# Altium project Power Circuit.PrjPcb
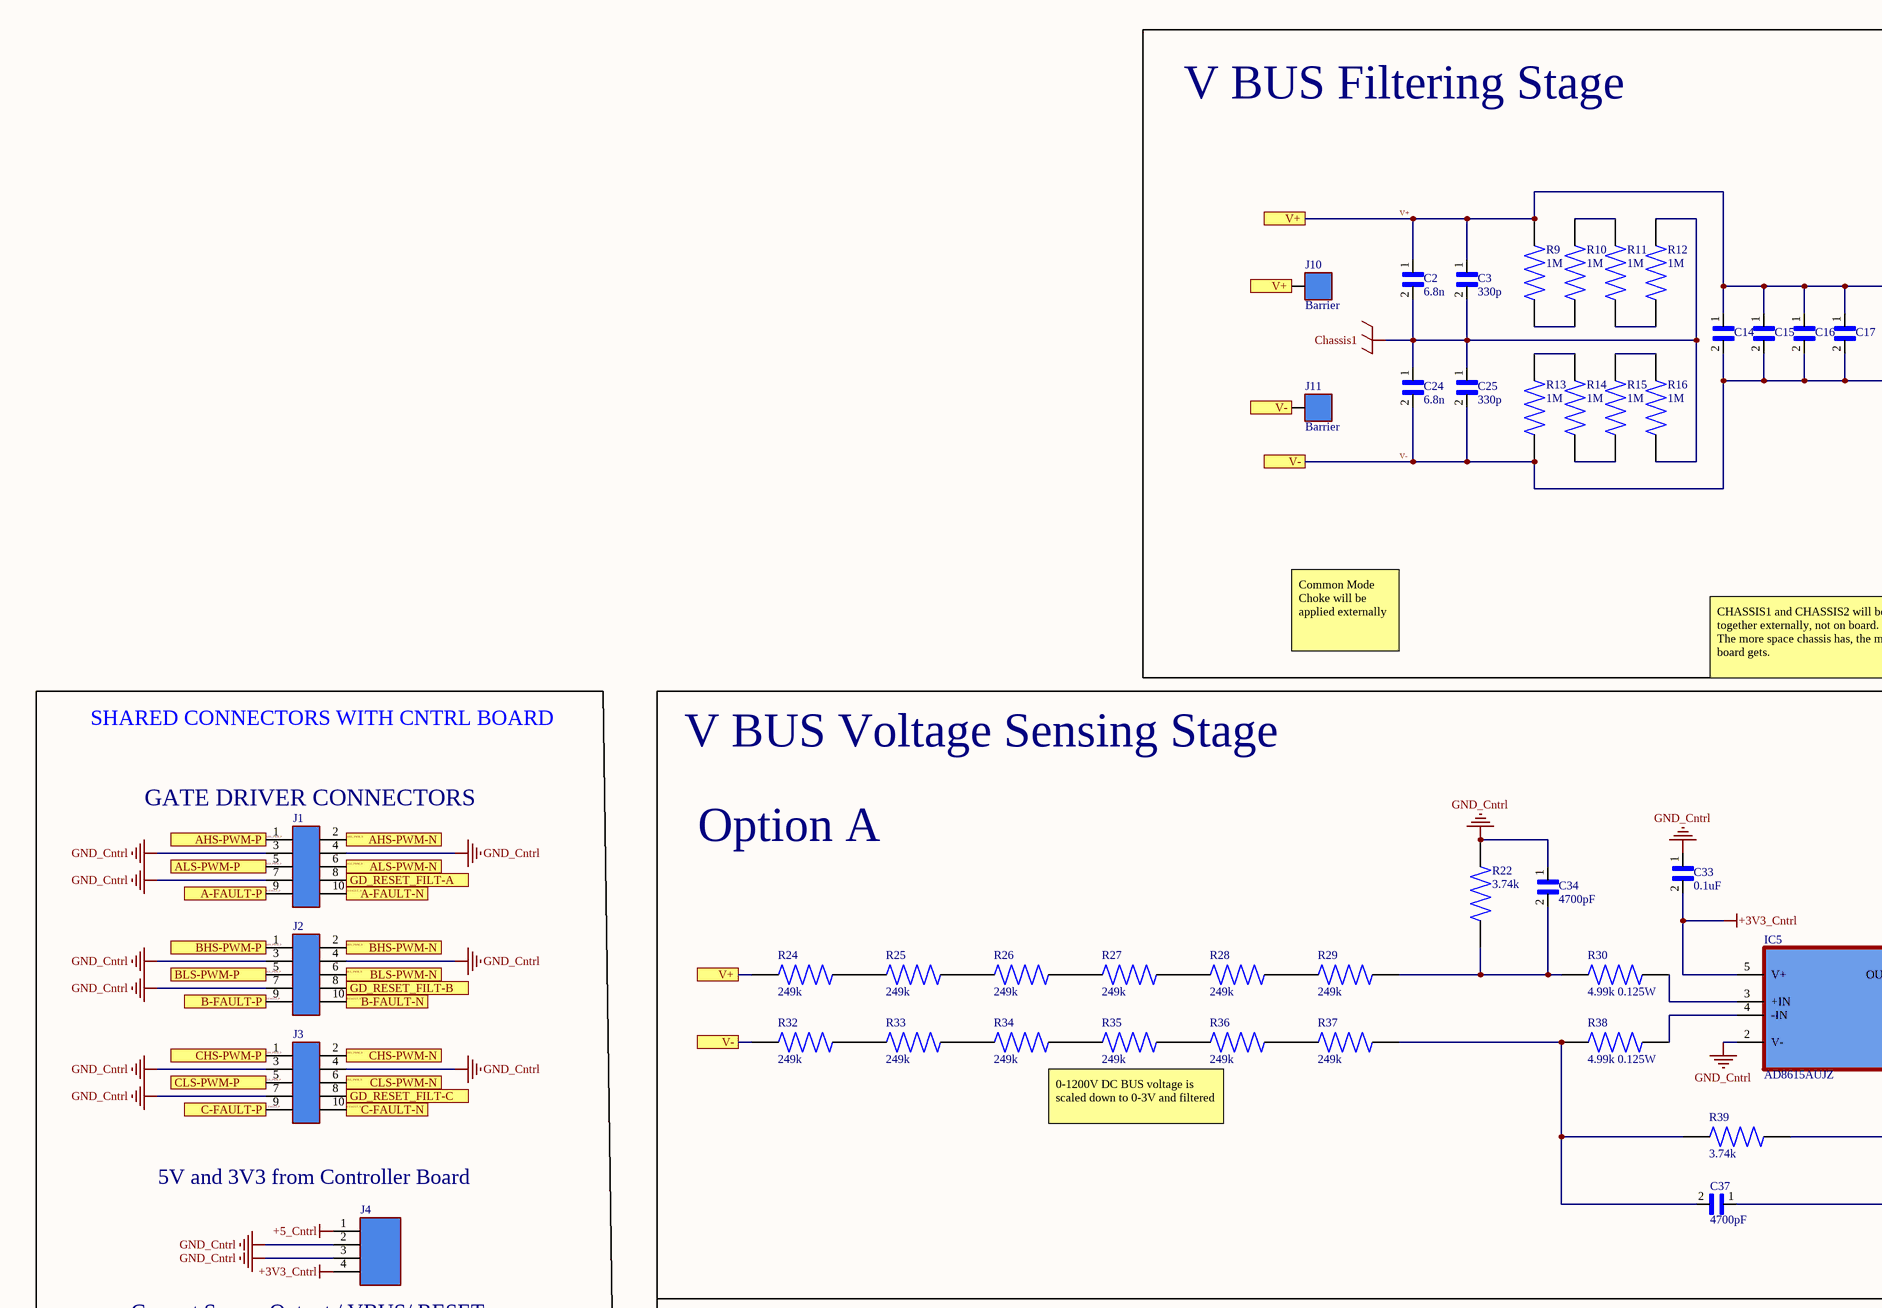
[diagram p0: Circuit.SchDoc, top left]
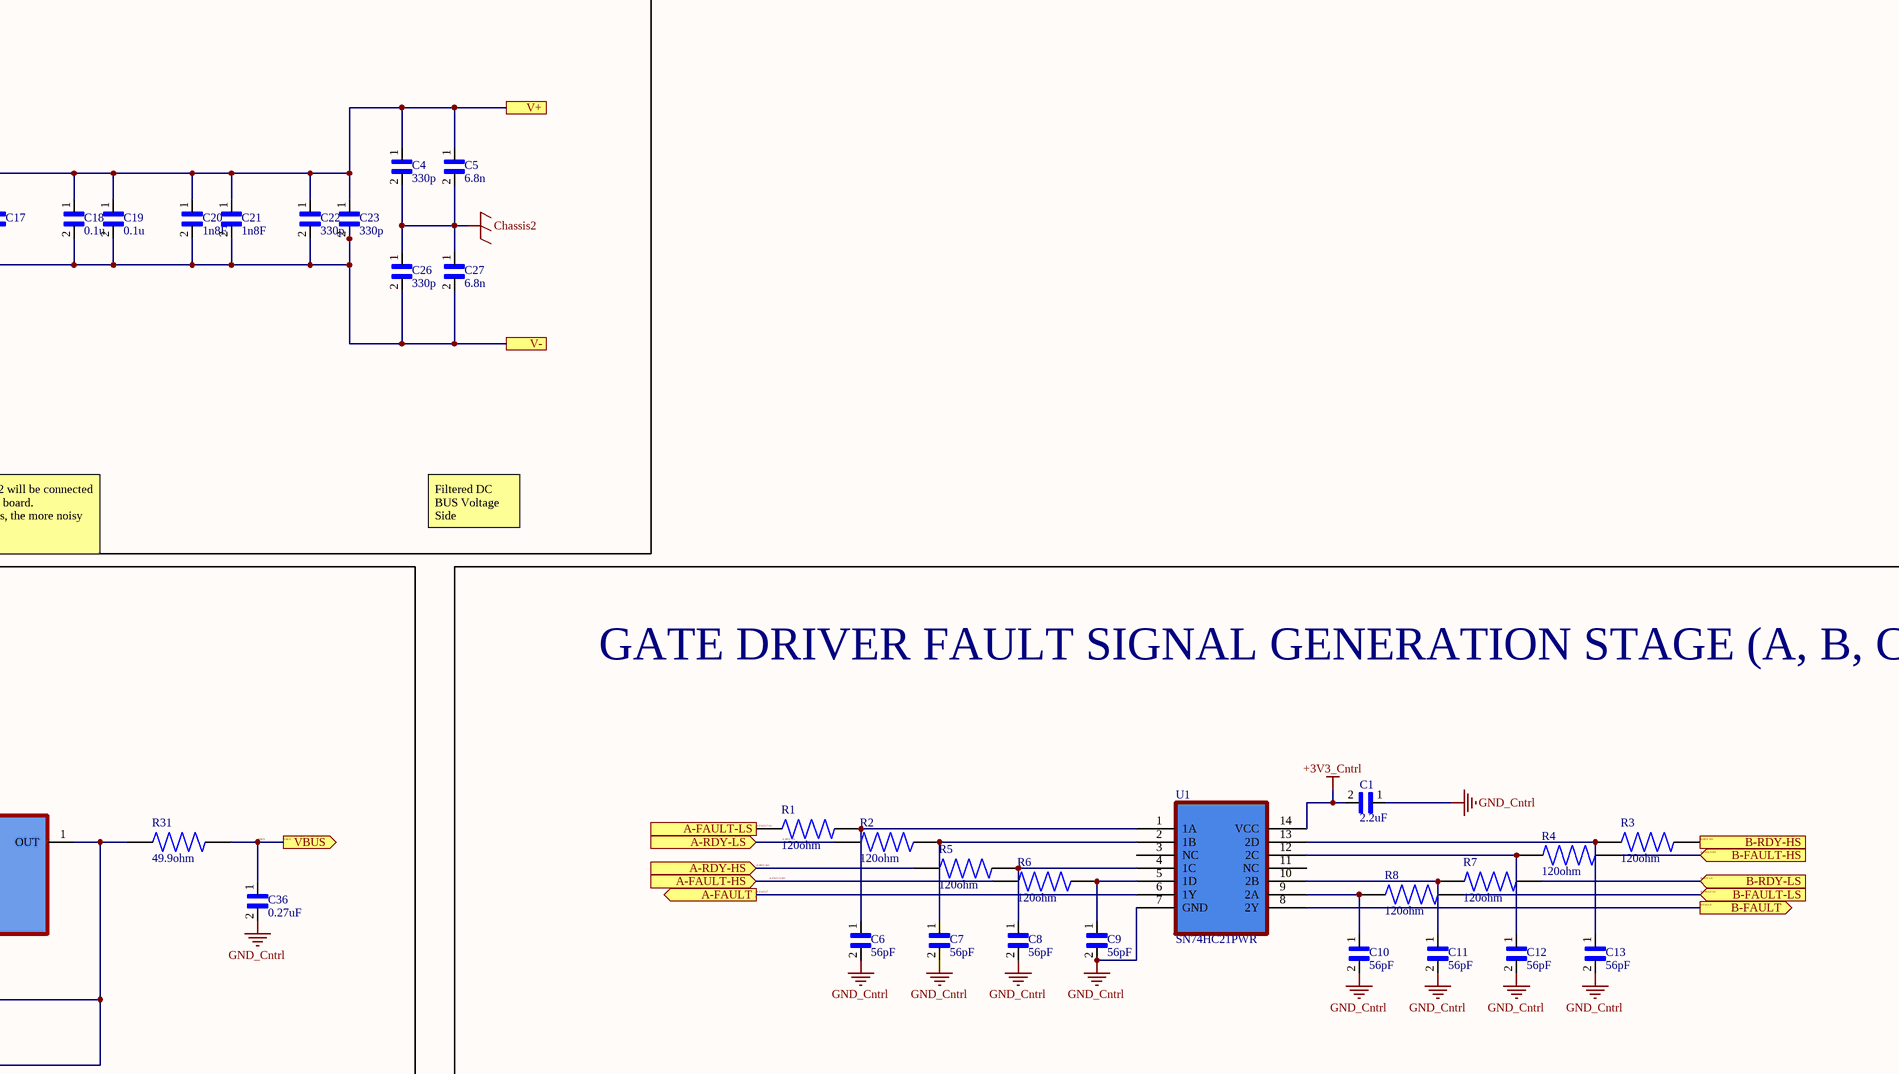
[diagram p1: Circuit.SchDoc, top right]
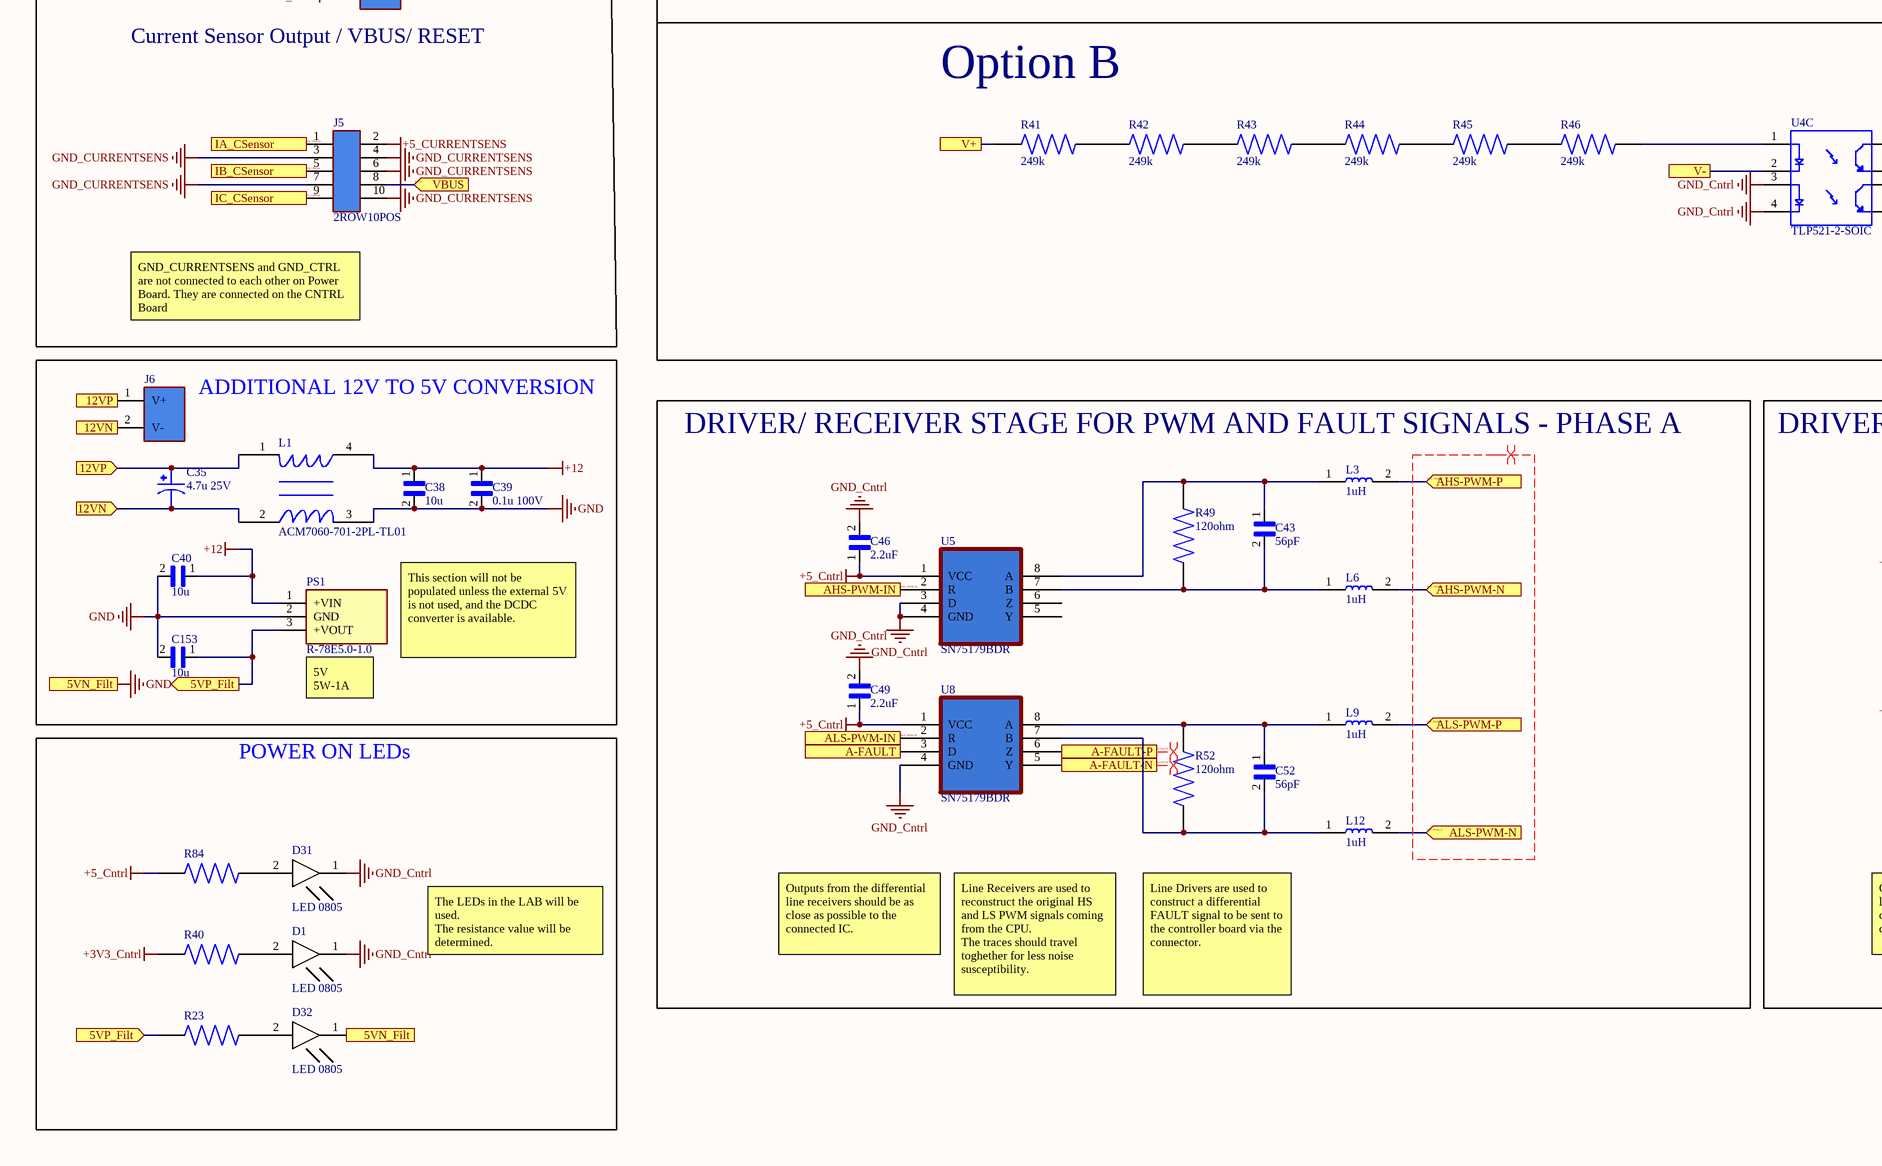
[diagram p2: Circuit.SchDoc, bottom left]
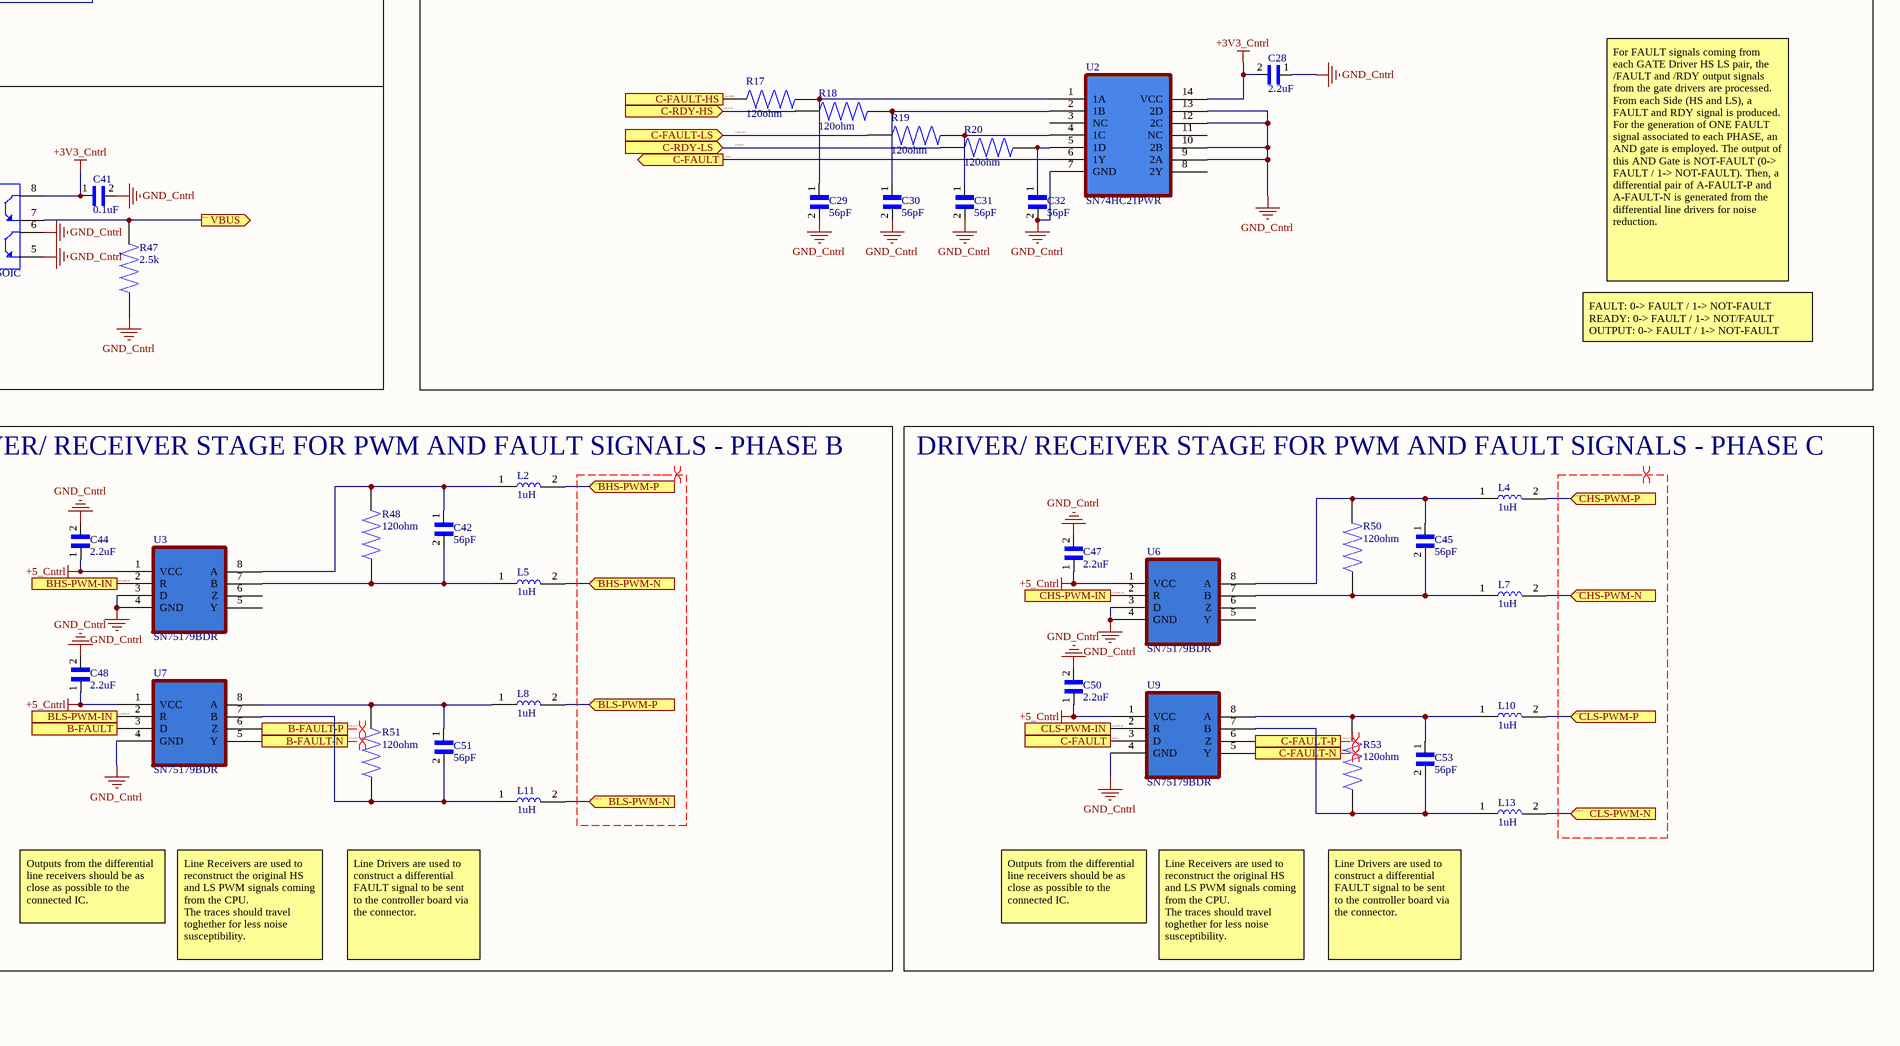
[diagram p3: Circuit.SchDoc, bottom right]
3 sheets, 399 parts. Net scope: flat (ports and power ports of the same name join across sheets).
Board file: Power Board.PcbDoc
Sheets:
  Circuit.SchDoc
  Gate Drives.SchDoc
  DCDC CONV.SchDoc

## Sheet Circuit.SchDoc
size D

### Parts
C1  2.2uF  [CAP 0805]
C2  6.8n  [6.8nF 1600VDC]
C3  330p  [330p 1000VDC]
C4  330p  [330p 1000VDC]
C5  6.8n  [6.8nF 1600VDC]
C6  56pF  [CAP 0805]
C7  56pF  [CAP 0805]
C8  56pF  [CAP 0805]
C9  56pF  [CAP 0805]
C10  56pF  [CAP 0805]
C11  56pF  [CAP 0805]
C12  56pF  [CAP 0805]
C13  56pF  [CAP 0805]
C14  20u 800VDC  [20u 800VDC v3]  (value not drawn)
C15  20u 800VDC  [20u 800VDC v3]  (value not drawn)
C16  20u 800VDC  [20u 800VDC v3]  (value not drawn)
C17  20u 800VDC  [20u 800VDC v3]  (value not drawn)
C18  0.1u  [0.1uF 630VDC]
C19  0.1u  [0.1uF 630VDC]
C20  1n8F  [1nF 100VDC]
C21  1n8F  [1nF 100VDC]
C22  330p  [330p 1000VDC]
C23  330p  [330p 1000VDC]
C24  6.8n  [6.8nF 1600VDC]
C25  330p  [330p 1000VDC]
C26  330p  [330p 1000VDC]
C27  6.8n  [6.8nF 1600VDC]
C28  2.2uF  [CAP 0805]
C29  56pF  [CAP 0805]
C30  56pF  [CAP 0805]
C31  56pF  [CAP 0805]
C32  56pF  [CAP 0805]
C33  0.1uF  [CAP 0805]
C34  4700pF  [CAP 0805]
C35  4.7u 25V  [EEE-HC1E470XP]
C36  0.27uF  [CAP 0805]
C37  4700pF  [CAP 0805]
C38  10u  [CAP 0805]
C39  0.1u 100V  [CAP 0805]
C40  10u  [CAP 0805]
C41  0.1uF  [CAP 0805]
C42  56pF  [CAP 0805]
C43  56pF  [CAP 0805]
C44  2.2uF  [CAP 0805]
C45  56pF  [CAP 0805]
C46  2.2uF  [CAP 0805]
C47  2.2uF  [CAP 0805]
C48  2.2uF  [CAP 0805]
C49  2.2uF  [CAP 0805]
C50  2.2uF  [CAP 0805]
C51  56pF  [CAP 0805]
C52  56pF  [CAP 0805]
C53  56pF  [CAP 0805]
C153  10u  [CAP 0805]
D1  LED 0805  [LED 0805]
D31  LED 0805  [LED 0805]
D32  LED 0805  [LED 0805]
IC5  AD8615AUJZ  [AD8615AUJZ]
J1  2ROW10POS  [2ROW10POS]  (value not drawn)
J2  2ROW10POS  [2ROW10POS]  (value not drawn)
J3  2ROW10POS  [2ROW10POS]  (value not drawn)
J4  4POS1ROW  [4POS1ROW]  (value not drawn)
J5  2ROW10POS  [2ROW10POS]
J6  2 POS CONN  [2POS CONN]  (value not drawn)
J10  Barrier  [Barrier]
J11  Barrier  [Barrier]
L1  ACM7060-701-2PL-TL01  [ACM7060-701-2PL-TL01]
L2  1uH  [IND 0805]
L3  1uH  [IND 0805]
L4  1uH  [IND 0805]
L5  1uH  [IND 0805]
L6  1uH  [IND 0805]
L7  1uH  [IND 0805]
L8  1uH  [IND 0805]
L9  1uH  [IND 0805]
L10  1uH  [IND 0805]
L11  1uH  [IND 0805]
L12  1uH  [IND 0805]
L13  1uH  [IND 0805]
PS1  R-78E5.0-1.0  [R78E5010]
R1  120ohm  [RES 0805 (2012 metric)]
R2  120ohm  [RES 0805 (2012 metric)]
R3  120ohm  [RES 0805 (2012 metric)]
R4  120ohm  [RES 0805 (2012 metric)]
R5  120ohm  [RES 0805 (2012 metric)]
R6  120ohm  [RES 0805 (2012 metric)]
R7  120ohm  [RES 0805 (2012 metric)]
R8  120ohm  [RES 0805 (2012 metric)]
R9  1M  [RESC3116X65N]
R10  1M  [RESC3116X65N]
R11  1M  [RESC3116X65N]
R12  1M  [RESC3116X65N]
R13  1M  [RESC3116X65N]
R14  1M  [RESC3116X65N]
R15  1M  [RESC3116X65N]
R16  1M  [RESC3116X65N]
R17  120ohm  [RES 0805 (2012 metric)]
R18  120ohm  [RES 0805 (2012 metric)]
R19  120ohm  [RES 0805 (2012 metric)]
R20  120ohm  [RES 0805 (2012 metric)]
R22  3.74k  [RES 0805 (2012 metric)]
R23  1.24k  [RES 0805 (2012 metric)]  (value not drawn)
R24  249k  [1206RES]
R25  249k  [1206RES]
R26  249k  [1206RES]
R27  249k  [1206RES]
R28  249k  [1206RES]
R29  249k  [1206RES]
R30  4.99k 0.125W  [RES 0805 (2012 metric)]
R31  49.9ohm  [RES 0805 (2012 metric)]
R32  249k  [1206RES]
R33  249k  [1206RES]
R34  249k  [1206RES]
R35  249k  [1206RES]
R36  249k  [1206RES]
R37  249k  [1206RES]
R38  4.99k 0.125W  [RES 0805 (2012 metric)]
R39  3.74k  [RES 0805 (2012 metric)]
R40  1.24k  [RES 0805 (2012 metric)]  (value not drawn)
R41  249k  [1206RES]
R42  249k  [1206RES]
R43  249k  [1206RES]
R44  249k  [1206RES]
R45  249k  [1206RES]
R46  249k  [1206RES]
R47  2.5k  [RES 0805 (2012 metric)]
R48  120ohm  [RES 0805 (2012 metric)]
R49  120ohm  [RES 0805 (2012 metric)]
R50  120ohm  [RES 0805 (2012 metric)]
R51  120ohm  [RES 0805 (2012 metric)]
R52  120ohm  [RES 0805 (2012 metric)]
R53  120ohm  [RES 0805 (2012 metric)]
R84  1.24k  [RES 0805 (2012 metric)]  (value not drawn)
U1  SN74HC21PWR  [SN74HC21PWR]
U2  SN74HC21PWR  [SN74HC21PWR]
U3  SN75179BDR  [SN75179BDR]
U4  TLP521-2-SOIC  [TLP521-2-SOIC]  (part C of 3)
U5  SN75179BDR  [SN75179BDR]
U6  SN75179BDR  [SN75179BDR]
U7  SN75179BDR  [SN75179BDR]
U8  SN75179BDR  [SN75179BDR]
U9  SN75179BDR  [SN75179BDR]

### Blocks framed on the sheet
V BUS Filtering Stage: C2-C5 C14-C27 J10 J11 R9-R16
GATE DRIVER CONNECTORS: J1-J5
GATE DRIVER FAULT SIGNAL GENERATION STAGE (A, B, C): C1 C6-C13 C28-C32 R1-R8 R17-R20 U1 U2
ADDITIONAL 12V TO 5V CONVERSION: C35 C38-C40 C153 J6 L1 PS1
DRIVER/ RECEIVER STAGE FOR PWM AND FAULT SIGNALS - PHASE A: C43 C46 C49 C52 L3 L6 L9 L12 R49 R52 U5 U8
DRIVER/ RECEIVER STAGE FOR PWM AND FAULT SIGNALS - PHASE B: C42 C44 C48 C51 L2 L5 L8 L11 R48 R51 U3 U7
DRIVER/ RECEIVER STAGE FOR PWM AND FAULT SIGNALS - PHASE C: C45 C47 C50 C53 L4 L7 L10 L13 R50 R53 U6 U9
POWER ON LEDs: D1 D31 D32 R23 R40 R84

### Ports
5VN_Filt (out), 5VP_Filt (in), 5VP_Filt (out), 12VN (in), 12VP (in), A-FAULT (in), A-FAULT (out), A-FAULT-HS (in), A-FAULT-LS (in), A-FAULT-N (in), A-FAULT-N (out), A-FAULT-P (in), A-FAULT-P (out), A-RDY-HS (in), A-RDY-LS (in), AHS-PWM-IN (out), AHS-PWM-N (in), AHS-PWM-N (out), AHS-PWM-P (in), AHS-PWM-P (out), ALS-PWM-IN (out), ALS-PWM-N (in), ALS-PWM-N (out), ALS-PWM-P (in), ALS-PWM-P (out), B-FAULT (in), B-FAULT (out), B-FAULT-HS (in), B-FAULT-LS (in), B-FAULT-N (in), B-FAULT-N (out), B-FAULT-P (in), B-FAULT-P (out), B-RDY-HS (in), B-RDY-LS (in), BHS-PWM-IN (out), BHS-PWM-N (in), BHS-PWM-N (out), BHS-PWM-P (in), BHS-PWM-P (out), BLS-PWM-IN (out), BLS-PWM-N (in), BLS-PWM-N (out), BLS-PWM-P (in), BLS-PWM-P (out), C-FAULT (in), C-FAULT (out), C-FAULT-HS (in), C-FAULT-LS (in), C-FAULT-N (in), C-FAULT-N (out), C-FAULT-P (in), C-FAULT-P (out), C-RDY-HS (in), C-RDY-LS (in), CHS-PWM-IN (out), CHS-PWM-N (in), CHS-PWM-N (out), CHS-PWM-P (in), CHS-PWM-P (out), CLS-PWM-IN (out), CLS-PWM-N (in), CLS-PWM-N (out), CLS-PWM-P (in), CLS-PWM-P (out), GD_RESET_FILT-A (in), GD_RESET_FILT-B (in), GD_RESET_FILT-C (in), IA_CSensor (in), IB_CSensor (in), IC_CSensor (in), V+, V-, VBUS (in), VBUS (out)

### Nets
+3V3_Cntrl: C1.2 C28.2 C33.2 C41.1 IC5.5(V+) J4.4 R40.2 U1.14(VCC) U2.14(VCC) U4.8
+5_Cntrl: C44.1 C46.1 C47.1 C48.1 C49.1 C50.1 J4.1 R84.2 U3.1(VCC) U5.1(VCC) U6.1(VCC) U7.1(VCC) U8.1(VCC) U9.1(VCC)
+5_CURRENTSENS: J5.2
+12: C38.1 C39.1 C40.1 L1.4 PS1.1(+VIN)
Chassis1: C2.2 C3.2 C24.1 C25.1 R12.2 R16.1
Chassis2: C4.2 C5.2 C26.1 C27.1
GND: C38.2 C39.2 C40.2 C153.2 D32.1(Cathode) L1.3 PS1.2(GND) ; port 5VN_Filt  [project net 5VN_FIlt]
GND_Cntrl: C1.1 C6.2 C7.2 C8.2 C9.2 C10.2 C11.2 C12.2 C13.2 C28.1 C29.2 C30.2 C31.2 C32.2 C33.1 C34.1 C36.2 C41.2 C44.2 C46.2 C47.2 C48.2 C49.2 C50.2 D1.1(Cathode) D31.1(Cathode) IC5.2(V-) J1.3 J1.4 J1.7 J2.3 J2.4 J2.7 J3.3 J3.4 J3.7 J4.2 J4.3 R22.2 R47.1 U1.7(GND) U2.7(GND) U2.9(2A) U2.10(2B) U2.12(2C) U2.13(2D) U3.3(D) U3.4(GND) U4.3 U4.4 U4.5 U4.6 U5.3(D) U5.4(GND) U6.3(D) U6.4(GND) U7.4(GND) U8.4(GND) U9.4(GND)
GND_CURRENTSENS: J5.3 J5.4 J5.6 J5.7 J5.10
5VP_FIlt: C153.1 PS1.3(+VOUT) R23.2 ; port 5VP_Filt
A-FAULT: U1.6(1Y) U8.3(D) ; port A-FAULT
A-FAULT-HS: R6.1 ; port A-FAULT-HS
A-FAULT-LS: R1.1 ; port A-FAULT-LS
A-FAULT_N: J1.10 U8.5(Y) ; port A-FAULT-N
A-FAULT_P: J1.9 U8.6(Z) ; port A-FAULT-P
A-RDY-HS: R5.1 ; port A-RDY-HS
A-RDY-LS: R2.1 ; port A-RDY-LS
AHS_PWM_IN: U5.2(R) ; port AHS-PWM-IN
AHS_PWM_N: J1.2 L6.2 ; port AHS-PWM-N
AHS_PWM_P: J1.1 L3.2 ; port AHS-PWM-P
ALS_PWM_IN: U8.2(R) ; port ALS-PWM-IN
ALS_PWM_N: J1.6 L12.2 ; port ALS-PWM-N
ALS_PWM_P: J1.5 L9.2 ; port ALS-PWM-P
B-FAULT: U1.8(2Y) U7.3(D) ; port B-FAULT
B-FAULT-HS: R4.2 ; port B-FAULT-HS
B-FAULT-LS: R8.2 ; port B-FAULT-LS
B-FAULT_N: J2.10 U7.5(Y) ; port B-FAULT-N
B-FAULT_P: J2.9 U7.6(Z) ; port B-FAULT-P
B-RDY-HS: R3.2 ; port B-RDY-HS
B-RDY-LS: R7.2 ; port B-RDY-LS
BHS_PWM_IN: U3.2(R) ; port BHS-PWM-IN
BHS_PWM_N: J2.2 L5.2 ; port BHS-PWM-N
BHS_PWM_P: J2.1 L2.2 ; port BHS-PWM-P
BLS_PWM_IN: U7.2(R) ; port BLS-PWM-IN
BLS_PWM_N: J2.6 L11.2 ; port BLS-PWM-N
BLS_PWM_P: J2.5 L8.2 ; port BLS-PWM-P
C-FAULT: U2.6(1Y) U9.3(D) ; port C-FAULT
C-FAULT-HS: R17.1 ; port C-FAULT-HS
C-FAULT-LS: R19.1 ; port C-FAULT-LS
C-FAULT_N: J3.10 U9.5(Y) ; port C-FAULT-N
C-FAULT_P: J3.9 U9.6(Z) ; port C-FAULT-P
C-RDY-HS: R18.1 ; port C-RDY-HS
C-RDY-LS: R20.1 ; port C-RDY-LS
CHS_PWM_IN: U6.2(R) ; port CHS-PWM-IN
CHS_PWM_N: J3.2 L7.2 ; port CHS-PWM-N
CHS_PWM_P: J3.1 L4.2 ; port CHS-PWM-P
CLS_PWM_IN: U9.2(R) ; port CLS-PWM-IN
CLS_PWM_N: J3.6 L13.2 ; port CLS-PWM-N
CLS_PWM_P: J3.5 L10.2 ; port CLS-PWM-P
V+: C2.1 C3.1 C4.1 C5.1 C14.1 C15.1 C16.1 C17.1 C18.1 C19.1 C20.1 C21.1 C22.1 C23.1 J10.1 R9.2 R24.1 R41.1 ; port V+
V-: C14.2 C15.2 C16.2 C17.2 C18.2 C19.2 C20.2 C21.2 C22.2 C23.2 C24.2 C25.2 C26.2 C27.2 J11.1 R13.1 R32.1 U4.2 ; port V-
VA_CSensor: J5.1 ; port IA_CSensor
VB_CSensor: J5.5 ; port IB_CSensor
VBUS: C36.1 J5.8 R31.2 R47.2 U4.7 ; port VBUS
VC_CSensor: J5.9 ; port IC_CSensor
NetC6_1: C6.1 R1.2 U1.1(1A)
NetC7_1: C7.1 R2.2 U1.2(1B)
NetC8_1: C8.1 R5.2 U1.4(1C)
NetC9_1: C9.1 R6.2 U1.5(1D)
NetC10_1: C10.1 R8.1 U1.9(2A)
NetC11_1: C11.1 R7.1 U1.10(2B)
NetC12_1: C12.1 R4.1 U1.12(2C)
NetC13_1: C13.1 R3.1 U1.13(2D)
NetC29_1: C29.1 R17.2 U2.1(1A)
NetC30_1: C30.1 R18.2 U2.2(1B)
NetC31_1: C31.1 R19.2 U2.4(1C)
NetC32_1: C32.1 R20.2 U2.5(1D)
NetC34_2: C34.2 R22.1 R29.2 R30.1
NetC35_1: C35.1 J6.1(V+) L1.1 ; port 12VP
NetC35_2: C35.2 J6.2(V-) L1.2 ; port 12VN
NetC37_1: C37.1 IC5.1(OUT) R31.1 R39.1
NetC37_2: C37.2 R37.2 R38.1 R39.2
NetC42_1: C42.1 L2.1 R48.2 U3.8(A)
NetC42_2: C42.2 L5.1 R48.1 U3.7(B)
NetC43_1: C43.1 L3.1 R49.2 U5.8(A)
NetC43_2: C43.2 L6.1 R49.1 U5.7(B)
NetC45_1: C45.1 L4.1 R50.2 U6.8(A)
NetC45_2: C45.2 L7.1 R50.1 U6.7(B)
NetC51_1: C51.1 L8.1 R51.2 U7.8(A)
NetC51_2: C51.2 L11.1 R51.1 U7.7(B)
NetC52_1: C52.1 L9.1 R52.2 U8.8(A)
NetC52_2: C52.2 L12.1 R52.1 U8.7(B)
NetC53_1: C53.1 L10.1 R53.2 U9.8(A)
NetC53_2: C53.2 L13.1 R53.1 U9.7(B)
NetD1_2: D1.2(Anode) R40.1
NetD31_2: D31.2(Anode) R84.1
NetD32_2: D32.2(Anode) R23.1
NetIC5_3: IC5.3(+IN) R30.2
NetIC5_4: IC5.4(-IN) R38.2
NetIC6_14: J3.8 ; port GD_RESET_FILT-C
NetIC7_14: J1.8 ; port GD_RESET_FILT-A
NetIC8_14: J2.8 ; port GD_RESET_FILT-B
NetR9_1: R9.1 R10.1
NetR10_2: R10.2 R11.2
NetR11_1: R11.1 R12.1
NetR13_2: R13.2 R14.2
NetR14_1: R14.1 R15.1
NetR15_2: R15.2 R16.2
NetR24_2: R24.2 R25.1
NetR25_2: R25.2 R26.1
NetR26_2: R26.2 R27.1
NetR27_2: R27.2 R28.1
NetR28_2: R28.2 R29.1
NetR32_2: R32.2 R33.1
NetR33_2: R33.2 R34.1
NetR34_2: R34.2 R35.1
NetR35_2: R35.2 R36.1
NetR36_2: R36.2 R37.1
NetR41_2: R41.2 R42.1
NetR42_2: R42.2 R43.1
NetR43_2: R43.2 R44.1
NetR44_2: R44.2 R45.1
NetR45_2: R45.2 R46.1
NetR46_2: R46.2 U4.1

Not connected (* = marked no-connect by the designer): U1 3(NC) 11(NC); U2 3(NC) 8(2Y) 11(NC); U3 5(Y) 6(Z); U5 5(Y) 6(Z); U6 5(Y) 6(Z)

### Layout directives
differential pair; differential pair class DIFF90: AHS_PWM_N, AHS_PWM_P, ALS_PWM_N, ALS_PWM_P, BHS_PWM_N, BHS_PWM_P, BLS_PWM_N, BLS_PWM_P, CHS_PWM_N, CHS_PWM_P, CLS_PWM_N, CLS_PWM_P
differential pair: A-FAULT_N, A-FAULT_P, B-FAULT_N, B-FAULT_P, C-FAULT_N, C-FAULT_P

### Notes on the sheet
- Common Mode Choke will be applied externally
- Filtered DC BUS Voltage Side
- CHASSIS1 and CHASSIS2 will be connected together externally, not on board.
  The more space chassis has, the more noisy the board gets.
- SHARED CONNECTORS WITH CNTRL BOARD
- V BUS Voltage Sensing Stage
- Option A
- 0-1200V DC BUS voltage is scaled down to 0-3V and filtered
- 5V and 3V3 from Controller Board
- (near J4) Current Sensor Output / VBUS/ RESET
- Option B
- For FAULT signals coming from each GATE Driver HS LS pair, the /FAULT and /RDY output signals from the gate drivers are processed. From each Side (HS and LS), a FAULT and RDY signal is produced. For the generation of ONE FAULT signal associated to each PHASE, an AND gate is employed. The output of this AND Gate is NOT-FAULT (0-> FAULT / 1-> NOT-FAULT). Then, a differential pair of A-FAULT-P and A-FAULT-N is generated from the differential line drivers for noise reduction.
- GND_CURRENTSENS and GND_CTRL are not connected to each other on Power Board. They are connected on the CNTRL Board
- FAULT: 0-> FAULT / 1-> NOT-FAULT
  READY: 0-> FAULT / 1-> NOT/FAULT
  OUTPUT: 0-> FAULT / 1-> NOT-FAULT
- This section will not be populated unless the external 5V is not used, and the DCDC converter is available.
- (near PS1) 5V
  5W-1A
- The LEDs in the LAB will be used.
  The resistance value will be determined.
- Outputs from the differential line receivers should be as close as possible to the connected IC.
- Line Receivers are used to reconstruct the original HS and LS PWM signals coming from the CPU.
  The traces should travel toghether for less noise susceptibility.
- Line Drivers are used to construct a differential FAULT signal to be sent to the controller board via the connector.

### Library data of the parts
C1 C28 C40 C44 C46-C50 C153 = 2.2uF 50V 0805
C2 C5 C24 C27 = 6.8nF 1600VDC
C3 C4 C22 C23 C25 C26 = C323A331K31C320: 330p 1000VDC
C6-C13 C29-C32 C42 C43 C45 C51-C53 = 56pF 0805: / 56 pF ±5% 100V Ceramic Capacitor C0G, NP0 0805 (2012 Metric
C18 C19 = 0.1uF 630VDC
C20 C21 = 1nF 100VDC: PHE850EA4100MA01R17
C33 C39 C41 = 0.1uF 0805
C34 C37 = 4700pF 0805: 4700pF 0805 cap
C35 = EEE-HC1E4
C36 = 0.27uF 0805
C38 = 0.1uF 0805: 10uF
L2-L13 = 1uH 0805: / 1 µH Shielded Multilayer Inductor 600 mA 150mOhm 0805(2012 metric)
PS1 = R-78E5.0-1.0: Power Supply; Manufacturer_Name: RECOM Power; Datasheet Link: http://www.recom-power.com/pdf/Innoline/R-78Exx-1.0.pdf; Height: 10.4mm; Manufacturer_Part_Number: R-78E5.0-1.0; Mouser Part Number: 919-R-78E5.0-1.0; Mouser Price/Stock: https://www.mouser.co.uk/ProductDetail/RECOM-Power/R-78E50-10/?qs=T0XSgvH75d4EsZCU9I5HVA%3D%3D; Arrow Part Number: R-78E5.0-1.0; Arrow Price/Stock: https://www.arrow.com/en/products/r-78e5.0-1.0/recom-power
R1-R8 R17-R20 R48-R53 = 120ohm 0805
R9-R16 = RE1206FRE071ML: RE1206 1,00M 1% 0,25W; Package: None; Price: None; Value: *; MP: RE1206FRE071ML; Availability: Unavailable
R22 R39 = 3.74k 0805: 3.74k 0805 resistor
R23 R40 R84 = 120ohm 0805: 1.24ohm 0805
R24-R29 R32-R37 R41-R46 = 249k 1206
R30 R38 = 4.99k 0.125W: 4.99k 0805 0.125W
R31 = 49.9ohm 0805
R47 = 2.5k 0805
U1 U2 = SN74HC21PWR: QUAD AND GATE
U3 U5-U9 = SN75179BDR: Differential Line Transceiver
U4 = TLP521

## Sheet Gate Drives.SchDoc
size D
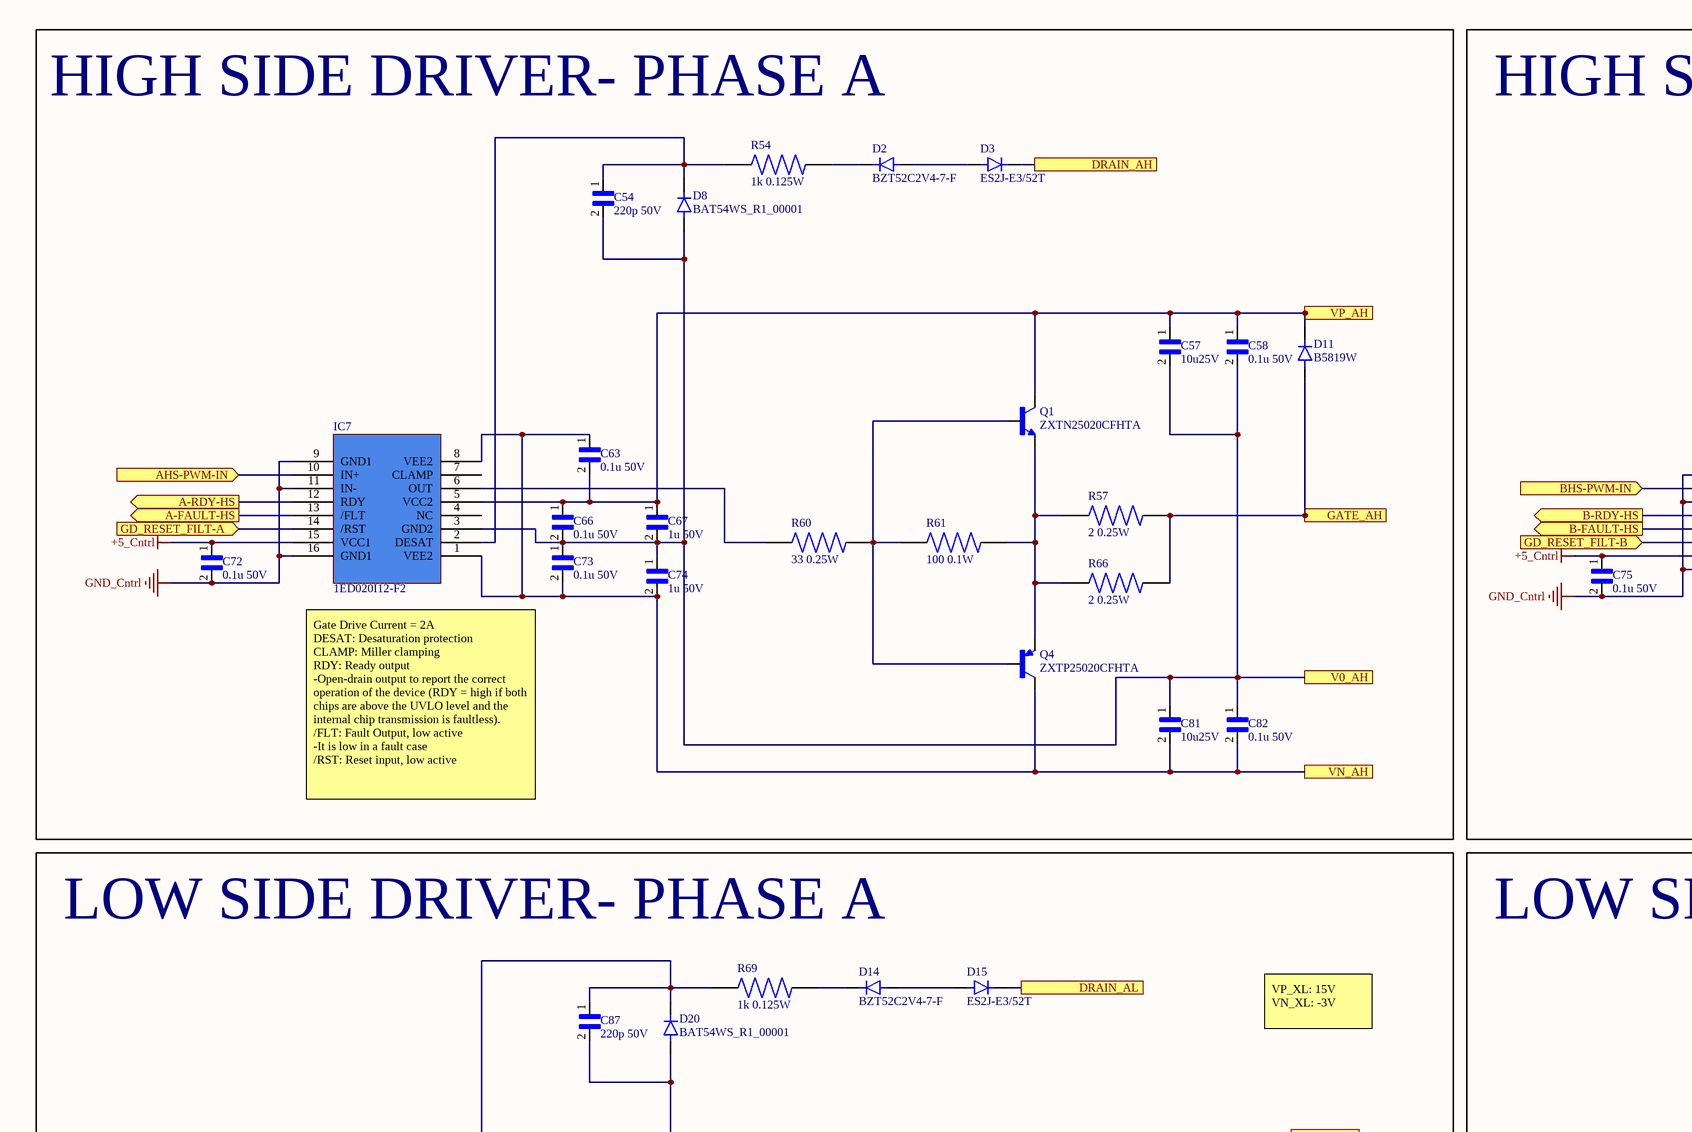
[diagram p4: Gate Drives.SchDoc, top left]
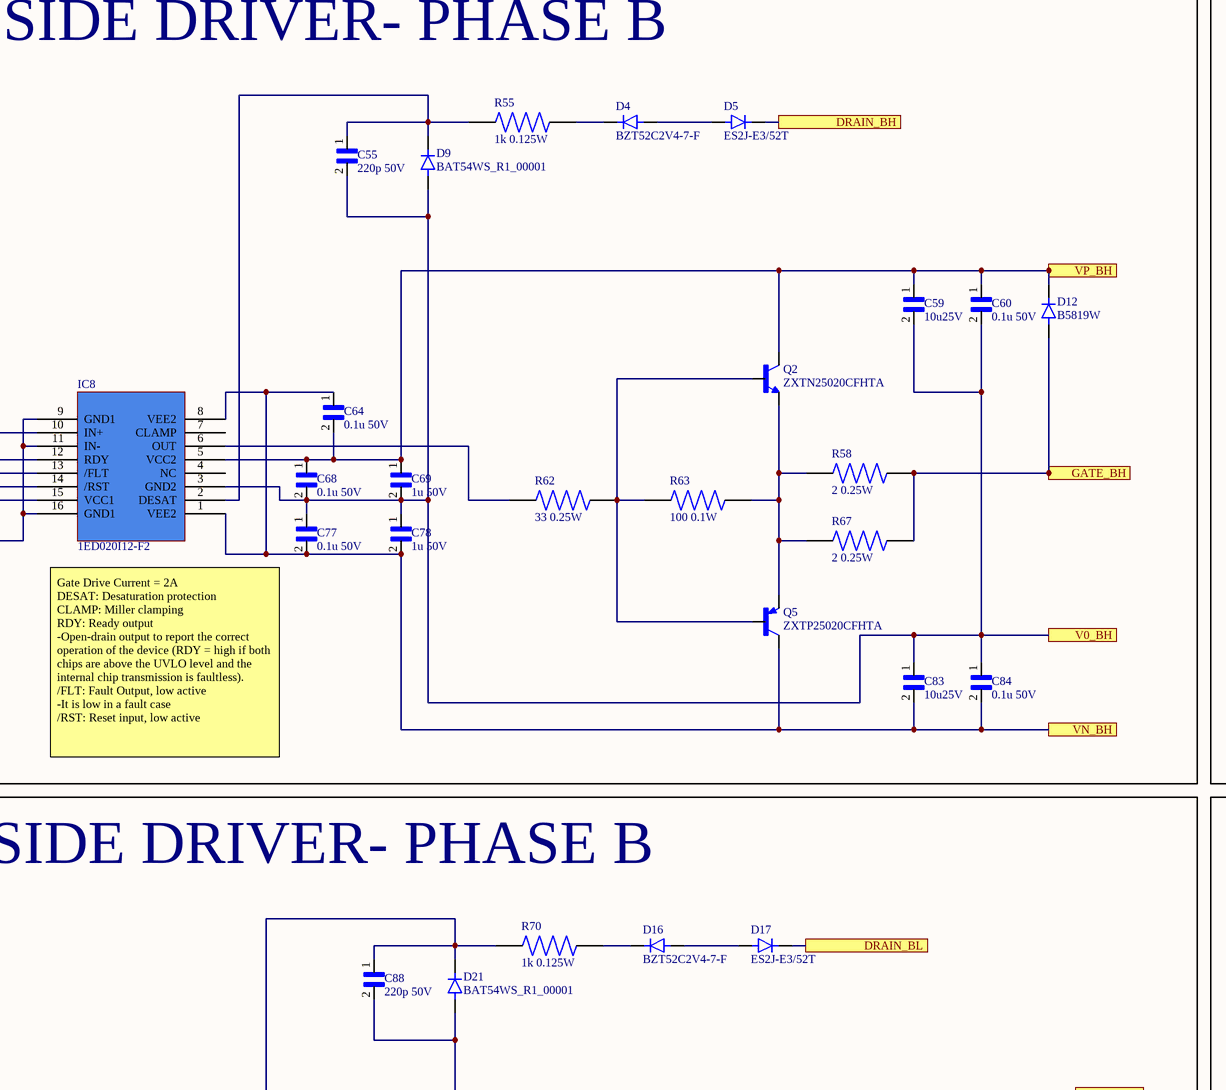
[diagram p5: Gate Drives.SchDoc, top middle]
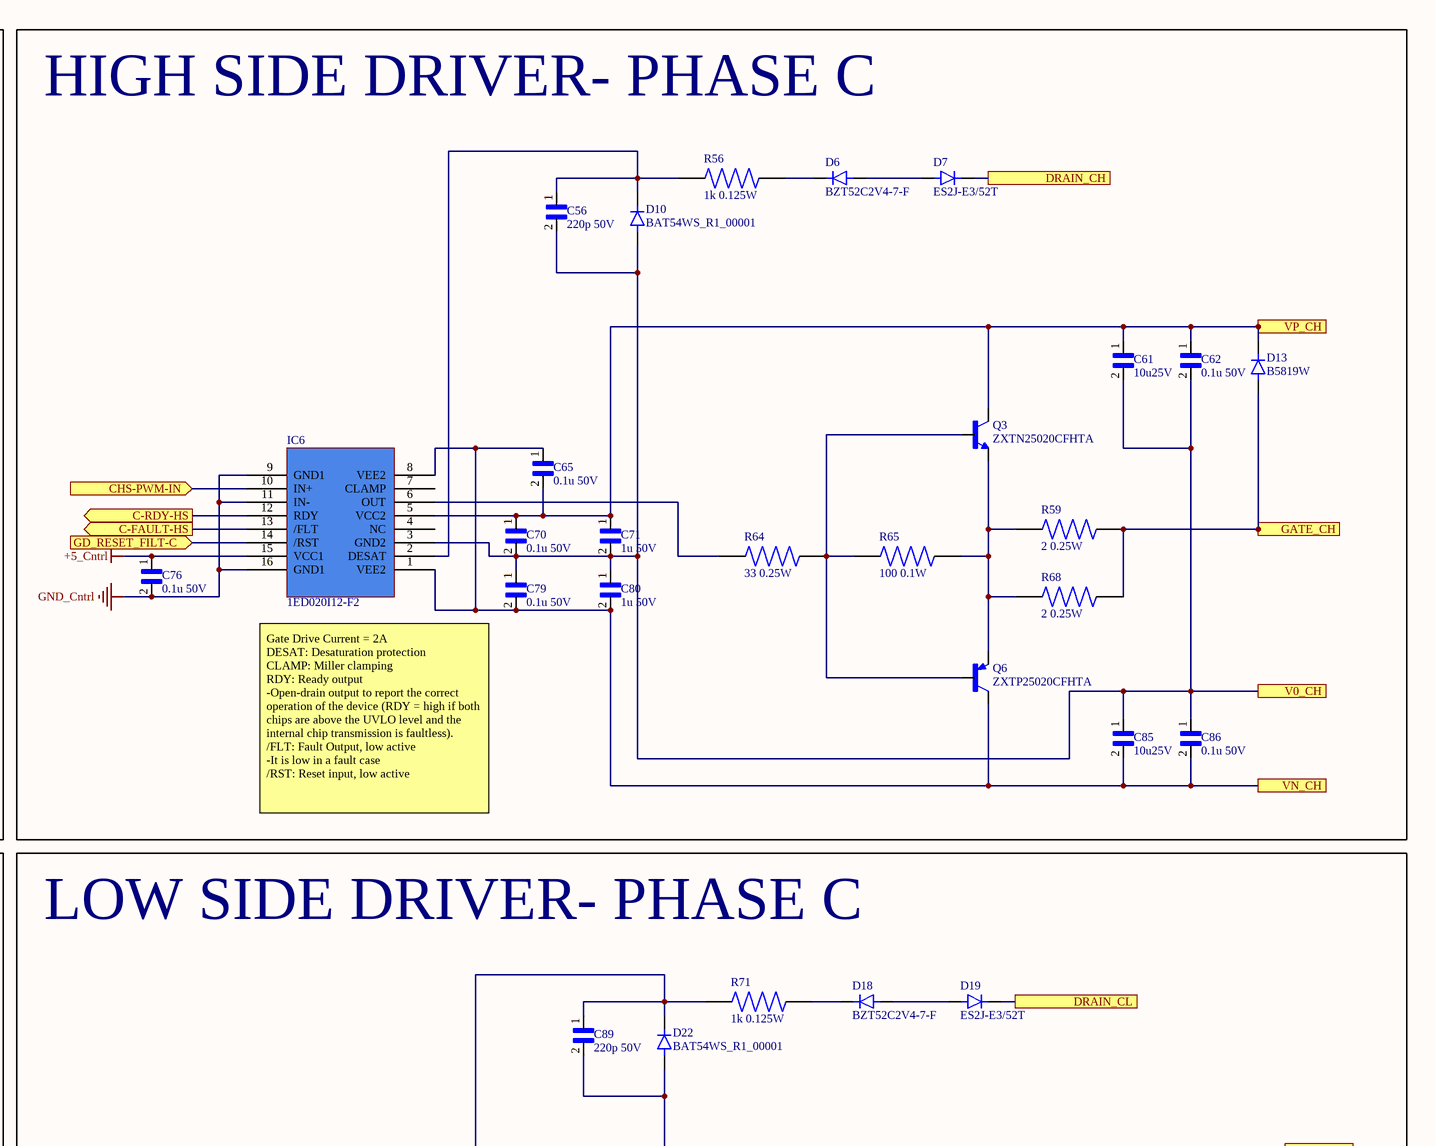
[diagram p6: Gate Drives.SchDoc, top right]
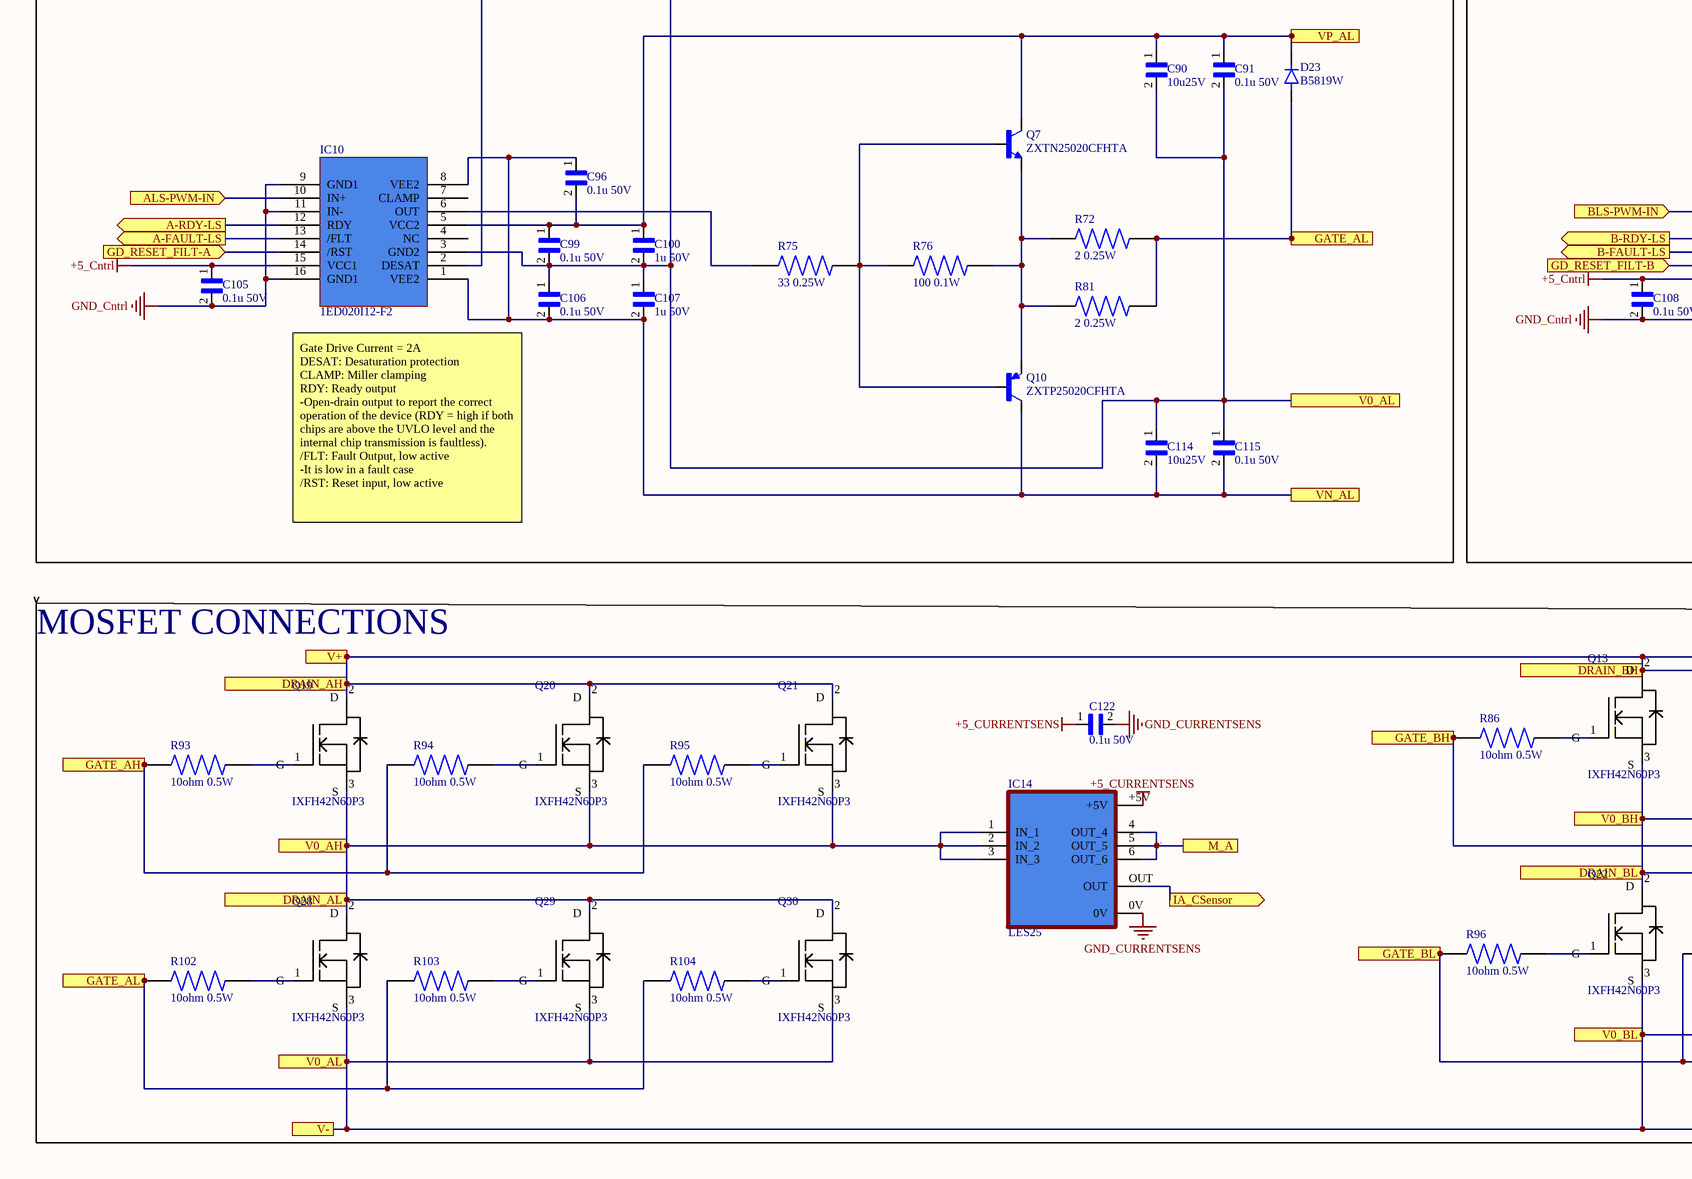
[diagram p7: Gate Drives.SchDoc, bottom left]
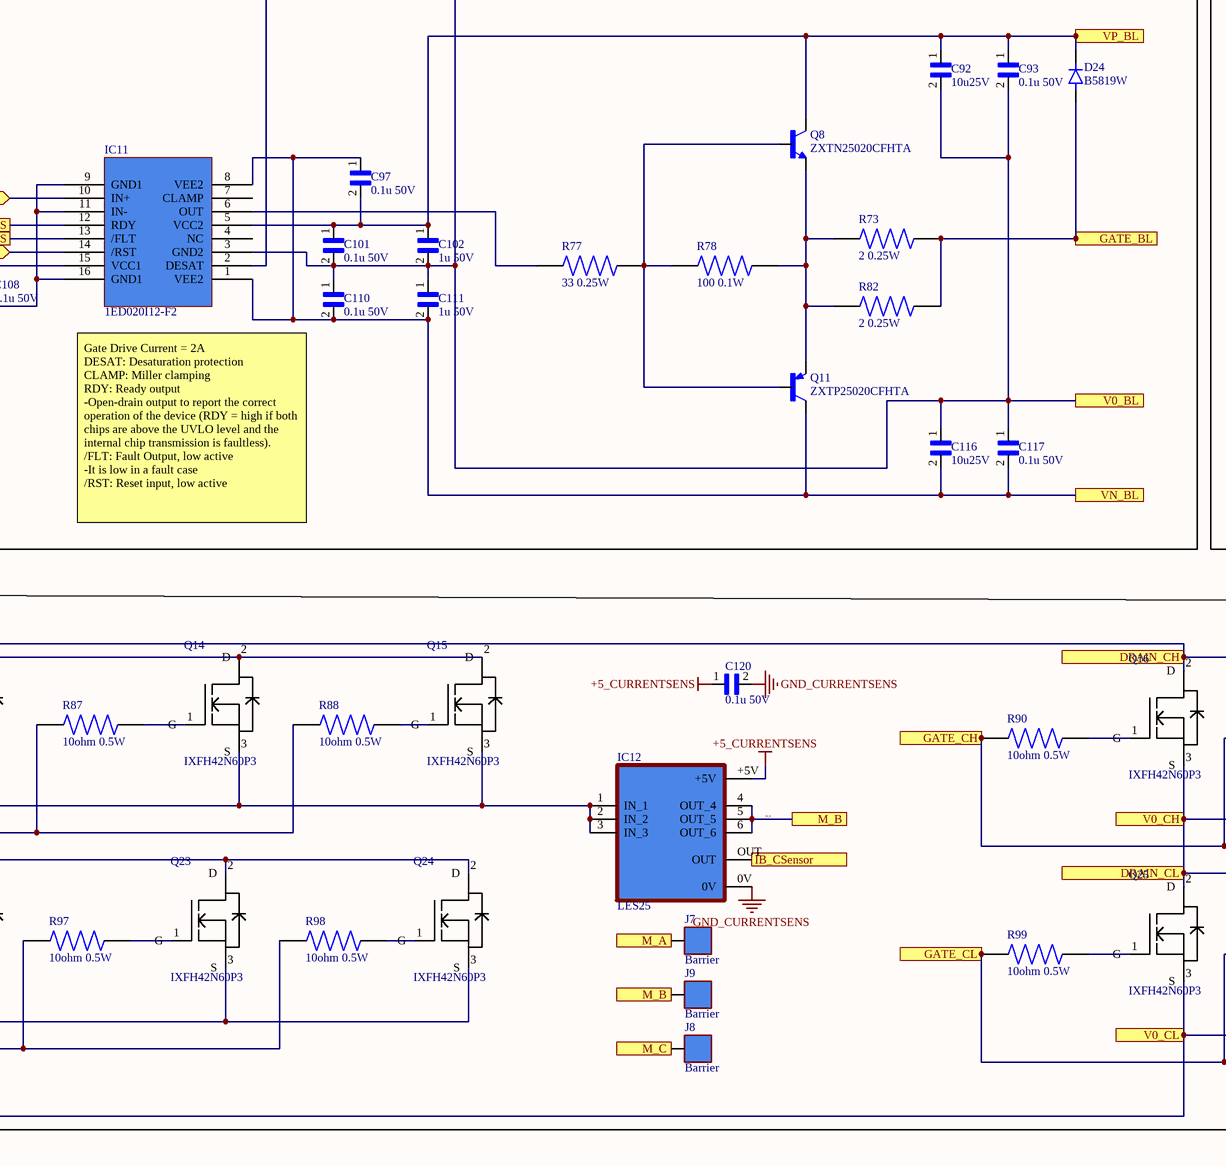
[diagram p8: Gate Drives.SchDoc, bottom middle]
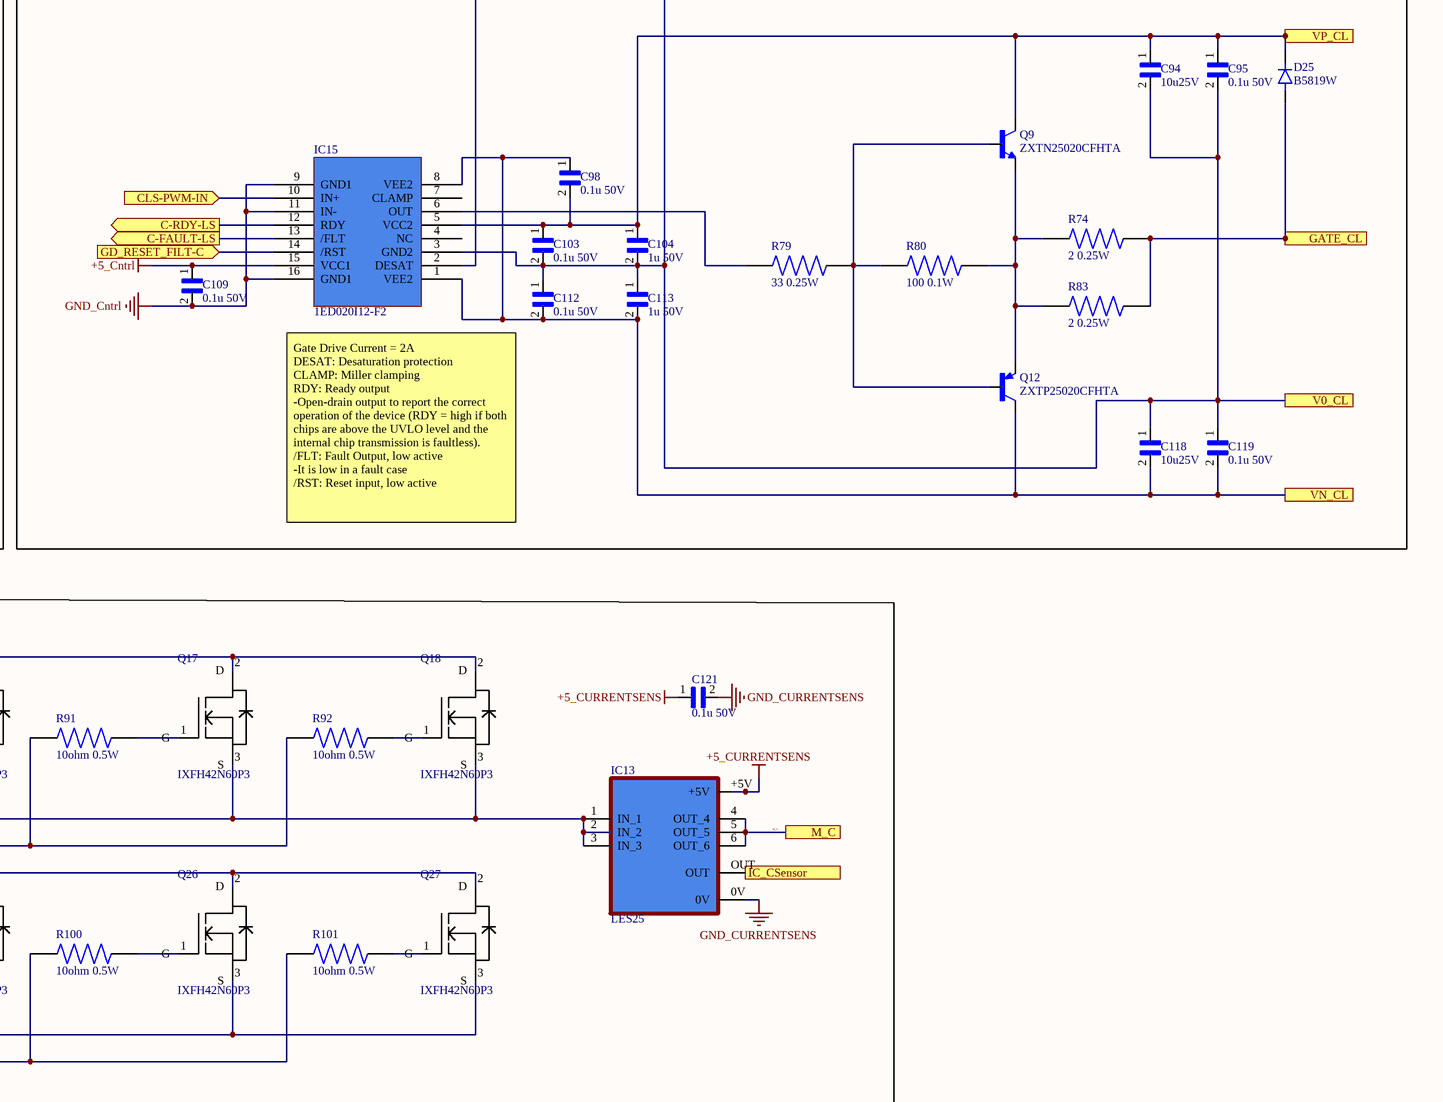
[diagram p9: Gate Drives.SchDoc, bottom right]

### Parts
C54  220p 50V  [CAP0805]
C55  220p 50V  [CAP0805]
C56  220p 50V  [CAP0805]
C57  10u25V  [CAP0805]
C58  0.1u 50V  [CAP0805]
C59  10u25V  [CAP0805]
C60  0.1u 50V  [CAP0805]
C61  10u25V  [CAP0805]
C62  0.1u 50V  [CAP0805]
C63  0.1u 50V  [CAP0805]
C64  0.1u 50V  [CAP0805]
C65  0.1u 50V  [CAP0805]
C66  0.1u 50V  [CAP0805]
C67  1u 50V  [CAP0805]
C68  0.1u 50V  [CAP0805]
C69  1u 50V  [CAP0805]
C70  0.1u 50V  [CAP0805]
C71  1u 50V  [CAP0805]
C72  0.1u 50V  [CAP0805]
C73  0.1u 50V  [CAP0805]
C74  1u 50V  [CAP0805]
C75  0.1u 50V  [CAP0805]
C76  0.1u 50V  [CAP0805]
C77  0.1u 50V  [CAP0805]
C78  1u 50V  [CAP0805]
C79  0.1u 50V  [CAP0805]
C80  1u 50V  [CAP0805]
C81  10u25V  [CAP0805]
C82  0.1u 50V  [CAP0805]
C83  10u25V  [CAP0805]
C84  0.1u 50V  [CAP0805]
C85  10u25V  [CAP0805]
C86  0.1u 50V  [CAP0805]
C87  220p 50V  [CAP0805]
C88  220p 50V  [CAP0805]
C89  220p 50V  [CAP0805]
C90  10u25V  [CAP0805]
C91  0.1u 50V  [CAP0805]
C92  10u25V  [CAP0805]
C93  0.1u 50V  [CAP0805]
C94  10u25V  [CAP0805]
C95  0.1u 50V  [CAP0805]
C96  0.1u 50V  [CAP0805]
C97  0.1u 50V  [CAP0805]
C98  0.1u 50V  [CAP0805]
C99  0.1u 50V  [CAP0805]
C100  1u 50V  [CAP0805]
C101  0.1u 50V  [CAP0805]
C102  1u 50V  [CAP0805]
C103  0.1u 50V  [CAP0805]
C104  1u 50V  [CAP0805]
C105  0.1u 50V  [CAP0805]
C106  0.1u 50V  [CAP0805]
C107  1u 50V  [CAP0805]
C108  0.1u 50V  [CAP0805]
C109  0.1u 50V  [CAP0805]
C110  0.1u 50V  [CAP0805]
C111  1u 50V  [CAP0805]
C112  0.1u 50V  [CAP0805]
C113  1u 50V  [CAP0805]
C114  10u25V  [CAP0805]
C115  0.1u 50V  [CAP0805]
C116  10u25V  [CAP0805]
C117  0.1u 50V  [CAP0805]
C118  10u25V  [CAP0805]
C119  0.1u 50V  [CAP0805]
C120  0.1u 50V  [CAP0805]
C121  0.1u 50V  [CAP0805]
C122  0.1u 50V  [CAP0805]
D2  BZT52C2V4-7-F  [BZT52C2V4-7-F]
D3  ES2J-E3/52T  [ES2J-E3/52T]
D4  BZT52C2V4-7-F  [BZT52C2V4-7-F]
D5  ES2J-E3/52T  [ES2J-E3/52T]
D6  BZT52C2V4-7-F  [BZT52C2V4-7-F]
D7  ES2J-E3/52T  [ES2J-E3/52T]
D8  BAT54WS_R1_00001  [BAT54WS_R1_00001]
D9  BAT54WS_R1_00001  [BAT54WS_R1_00001]
D10  BAT54WS_R1_00001  [BAT54WS_R1_00001]
D11  B5819W  [BZT52C2V4-7-F]
D12  B5819W  [BZT52C2V4-7-F]
D13  B5819W  [BZT52C2V4-7-F]
D14  BZT52C2V4-7-F  [BZT52C2V4-7-F]
D15  ES2J-E3/52T  [ES2J-E3/52T]
D16  BZT52C2V4-7-F  [BZT52C2V4-7-F]
D17  ES2J-E3/52T  [ES2J-E3/52T]
D18  BZT52C2V4-7-F  [BZT52C2V4-7-F]
D19  ES2J-E3/52T  [ES2J-E3/52T]
D20  BAT54WS_R1_00001  [BAT54WS_R1_00001]
D21  BAT54WS_R1_00001  [BAT54WS_R1_00001]
D22  BAT54WS_R1_00001  [BAT54WS_R1_00001]
D23  B5819W  [BZT52C2V4-7-F]
D24  B5819W  [BZT52C2V4-7-F]
D25  B5819W  [BZT52C2V4-7-F]
IC6  1ED020I12-F2  [SOIC127P1028X264-16N]
IC7  1ED020I12-F2  [SOIC127P1028X264-16N]
IC8  1ED020I12-F2  [SOIC127P1028X264-16N]
IC10  1ED020I12-F2  [SOIC127P1028X264-16N]
IC11  1ED020I12-F2  [SOIC127P1028X264-16N]
IC12  LES25  [LTS25]
IC13  LES25  [LTS25]
IC14  LES25  [LTS25]
IC15  1ED020I12-F2  [SOIC127P1028X264-16N]
J7  Barrier  [Barrier]
J8  Barrier  [Barrier]
J9  Barrier  [Barrier]
Q1  ZXTN25020CFHTA  [SOT23]
Q2  ZXTN25020CFHTA  [SOT23]
Q3  ZXTN25020CFHTA  [SOT23]
Q4  ZXTP25020CFHTA  [SOT23]
Q5  ZXTP25020CFHTA  [SOT23]
Q6  ZXTP25020CFHTA  [SOT23]
Q7  ZXTN25020CFHTA  [SOT23]
Q8  ZXTN25020CFHTA  [SOT23]
Q9  ZXTN25020CFHTA  [SOT23]
Q10  ZXTP25020CFHTA  [SOT23]
Q11  ZXTP25020CFHTA  [SOT23]
Q12  ZXTP25020CFHTA  [SOT23]
Q13  IXFH42N60P3  [IXFH42N60P3_v4]
Q14  IXFH42N60P3  [IXFH42N60P3_v4]
Q15  IXFH42N60P3  [IXFH42N60P3_v4]
Q16  IXFH42N60P3  [IXFH42N60P3_v4]
Q17  IXFH42N60P3  [IXFH42N60P3_v4]
Q18  IXFH42N60P3  [IXFH42N60P3_v4]
Q19  IXFH42N60P3  [IXFH42N60P3_v4]
Q20  IXFH42N60P3  [IXFH42N60P3_v4]
Q21  IXFH42N60P3  [IXFH42N60P3_v4]
Q22  IXFH42N60P3  [IXFH42N60P3_v4]
Q23  IXFH42N60P3  [IXFH42N60P3_v4]
Q24  IXFH42N60P3  [IXFH42N60P3_v4]
Q25  IXFH42N60P3  [IXFH42N60P3_v4]
Q26  IXFH42N60P3  [IXFH42N60P3_v4]
Q27  IXFH42N60P3  [IXFH42N60P3_v4]
Q28  IXFH42N60P3  [IXFH42N60P3_v4]
Q29  IXFH42N60P3  [IXFH42N60P3_v4]
Q30  IXFH42N60P3  [IXFH42N60P3_v4]
R54  1k 0.125W  [RES0805]
R55  1k 0.125W  [RES0805]
R56  1k 0.125W  [RES0805]
R57  2 0.25W  [RES0805]
R58  2 0.25W  [RES0805]
R59  2 0.25W  [RES0805]
R60  33 0.25W  [RES0805]
R61  100 0.1W  [RES0805]
R62  33 0.25W  [RES0805]
R63  100 0.1W  [RES0805]
R64  33 0.25W  [RES0805]
R65  100 0.1W  [RES0805]
R66  2 0.25W  [RES0805]
R67  2 0.25W  [RES0805]
R68  2 0.25W  [RES0805]
R69  1k 0.125W  [RES0805]
R70  1k 0.125W  [RES0805]
R71  1k 0.125W  [RES0805]
R72  2 0.25W  [RES0805]
R73  2 0.25W  [RES0805]
R74  2 0.25W  [RES0805]
R75  33 0.25W  [RES0805]
R76  100 0.1W  [RES0805]
R77  33 0.25W  [RES0805]
R78  100 0.1W  [RES0805]
R79  33 0.25W  [RES0805]
R80  100 0.1W  [RES0805]
R81  2 0.25W  [RES0805]
R82  2 0.25W  [RES0805]
R83  2 0.25W  [RES0805]
R86  10ohm 0.5W  [1206RES]
R87  10ohm 0.5W  [1206RES]
R88  10ohm 0.5W  [1206RES]
R90  10ohm 0.5W  [1206RES]
R91  10ohm 0.5W  [1206RES]
R92  10ohm 0.5W  [1206RES]
R93  10ohm 0.5W  [1206RES]
R94  10ohm 0.5W  [1206RES]
R95  10ohm 0.5W  [1206RES]
R96  10ohm 0.5W  [1206RES]
R97  10ohm 0.5W  [1206RES]
R98  10ohm 0.5W  [1206RES]
R99  10ohm 0.5W  [1206RES]
R100  10ohm 0.5W  [1206RES]
R101  10ohm 0.5W  [1206RES]
R102  10ohm 0.5W  [1206RES]
R103  10ohm 0.5W  [1206RES]
R104  10ohm 0.5W  [1206RES]

### Blocks framed on the sheet
HIGH SIDE DRIVER- PHASE A: C54 C57 C58 C63 C66 C67 C72-C74 C81 C82 D2 D3 D8 D11 IC7 Q1 Q4 R54 R57 R60 R61 R66
HIGH SIDE DRIVER- PHASE B: C55 C59 C60 C64 C68 C69 C75 C77 C78 C83 C84 D4 D5 D9 D12 IC8 Q2 Q5 R55 R58 R62 R63 R67
HIGH SIDE DRIVER- PHASE C: C56 C61 C62 C65 C70 C71 C76 C79 C80 C85 C86 D6 D7 D10 D13 IC6 Q3 Q6 R56 R59 R64 R65 R68
LOW SIDE DRIVER- PHASE A: C87 C90 C91 C96 C99 C100 C105-C107 C114 C115 D14 D15 D20 D23 IC10 Q7 Q10 R69 R72 R75 R76 R81
LOW SIDE DRIVER- PHASE B: C88 C92 C93 C97 C101 C102 C108 C110 C111 C116 C117 D16 D17 D21 D24 IC11 Q8 Q11 R70 R73 R77 R78 R82
LOW SIDE DRIVER- PHASE C: C89 C94 C95 C98 C103 C104 C109 C112 C113 C118 C119 D18 D19 D22 D25 IC15 Q9 Q12 R71 R74 R79 R80 R83
MOSFET CONNECTIONS: C120-C122 IC12-IC14 J7-J9 Q13-Q30 R86-R88 R90-R104

### Ports
A-FAULT-HS (out), A-FAULT-LS (out), A-RDY-HS (out), A-RDY-LS (out), AHS-PWM-IN (in), ALS-PWM-IN (in), B-FAULT-HS (out), B-FAULT-LS (out), B-RDY-HS (out), B-RDY-LS (out), BHS-PWM-IN (in), BLS-PWM-IN (in), C-FAULT-HS (out), C-FAULT-LS (out), C-RDY-HS (out), C-RDY-LS (out), CHS-PWM-IN (in), CLS-PWM-IN (in), DRAIN_AH, DRAIN_AL, DRAIN_BH, DRAIN_BL, DRAIN_CH, DRAIN_CL, GATE_AH, GATE_AL, GATE_BH, GATE_BL, GATE_CH, GATE_CL, GD_RESET_FILT-A (in), GD_RESET_FILT-B (in), GD_RESET_FILT-C (in), IA_CSensor (out), IB_CSensor (out), IC_CSensor (out), M_A, M_B, M_C, V0_AH, V0_AL, V0_BH, V0_BL, V0_CH, V0_CL, V+, V-, VN_AH, VN_AL, VN_BH, VN_BL, VN_CH, VN_CL, VP_AH, VP_AL, VP_BH, VP_BL, VP_CH, VP_CL

### Nets
+5_Cntrl: C72.1 C75.1 C76.1 C105.1 C108.1 C109.1 IC6.15(VCC1) IC7.15(VCC1) IC8.15(VCC1) IC10.15(VCC1) IC11.15(VCC1) IC15.15(VCC1)
+5_CURRENTSENS: C120.1 C121.1 C122.1 IC12.+5V IC13.+5V IC14.+5V
GND_Cntrl: C72.2 C75.2 C76.2 C105.2 C108.2 C109.2 IC6.9(GND1) IC6.11(IN-) IC6.16(GND1) IC7.9(GND1) IC7.11(IN-) IC7.16(GND1) IC8.9(GND1) IC8.11(IN-) IC8.16(GND1) IC10.9(GND1) IC10.11(IN-) IC10.16(GND1) IC11.9(GND1) IC11.11(IN-) IC11.16(GND1) IC15.9(GND1) IC15.11(IN-) IC15.16(GND1)
GND_CURRENTSENS: C120.2 C121.2 C122.2 IC12.0V IC13.0V IC14.0V
A-FAULT-HS: IC7.13(/FLT) ; port A-FAULT-HS
A-FAULT-LS: IC10.13(/FLT) ; port A-FAULT-LS
A-RDY-HS: IC7.12(RDY) ; port A-RDY-HS
A-RDY-LS: IC10.12(RDY) ; port A-RDY-LS
AHS_PWM_IN: IC7.10(IN+) ; port AHS-PWM-IN
ALS_PWM_IN: IC10.10(IN+) ; port ALS-PWM-IN
B-FAULT-HS: IC8.13(/FLT) ; port B-FAULT-HS
B-FAULT-LS: IC11.13(/FLT) ; port B-FAULT-LS
B-RDY-HS: IC8.12(RDY) ; port B-RDY-HS
B-RDY-LS: IC11.12(RDY) ; port B-RDY-LS
BHS_PWM_IN: IC8.10(IN+) ; port BHS-PWM-IN
BLS_PWM_IN: IC11.10(IN+) ; port BLS-PWM-IN
C-FAULT-HS: IC6.13(/FLT) ; port C-FAULT-HS
C-FAULT-LS: IC15.13(/FLT) ; port C-FAULT-LS
C-RDY-HS: IC6.12(RDY) ; port C-RDY-HS
C-RDY-LS: IC15.12(RDY) ; port C-RDY-LS
CHS_PWM_IN: IC6.10(IN+) ; port CHS-PWM-IN
CLS_PWM_IN: IC15.10(IN+) ; port CLS-PWM-IN
M_A: IC14.4(OUT_4) IC14.5(OUT_5) IC14.6(OUT_6) J7.1 ; port M_A
M_B: IC12.4(OUT_4) IC12.5(OUT_5) IC12.6(OUT_6) J9.1 ; port M_B
M_C: IC13.4(OUT_4) IC13.5(OUT_5) IC13.6(OUT_6) J8.1 ; port M_C
V0_AH: C54.2 C57.2 C58.2 C66.2 C67.2 C73.1 C74.1 C81.1 C82.1 D8.2(Anode) D15.1(Cathode) IC7.3(GND2) IC14.1(IN_1) IC14.2(IN_2) IC14.3(IN_3) Q19.3(S) Q20.3(S) Q21.3(S) Q28.2(D) Q29.2(D) Q30.2(D) ; port V0_AH, port DRAIN_AL
V0_BH: C55.2 C59.2 C60.2 C68.2 C69.2 C77.1 C78.1 C83.1 C84.1 D9.2(Anode) D17.1(Cathode) IC8.3(GND2) IC12.1(IN_1) IC12.2(IN_2) IC12.3(IN_3) Q13.3(S) Q14.3(S) Q15.3(S) Q22.2(D) Q23.2(D) Q24.2(D) ; port V0_BH, port DRAIN_BL
V0_CH: C56.2 C61.2 C62.2 C70.2 C71.2 C79.1 C80.1 C85.1 C86.1 D10.2(Anode) D19.1(Cathode) IC6.3(GND2) IC13.1(IN_1) IC13.2(IN_2) IC13.3(IN_3) Q16.3(S) Q17.3(S) Q18.3(S) Q25.2(D) Q26.2(D) Q27.2(D) ; port V0_CH, port DRAIN_CL
V+: D3.1(Cathode) D5.1(Cathode) D7.1(Cathode) Q13.2(D) Q14.2(D) Q15.2(D) Q16.2(D) Q17.2(D) Q18.2(D) Q19.2(D) Q20.2(D) Q21.2(D) ; port DRAIN_AH, port DRAIN_BH, port DRAIN_CH, port V+
V-: C87.2 C88.2 C89.2 C90.2 C91.2 C92.2 C93.2 C94.2 C95.2 C99.2 C100.2 C101.2 C102.2 C103.2 C104.2 C106.1 C107.1 C110.1 C111.1 C112.1 C113.1 C114.1 C115.1 C116.1 C117.1 C118.1 C119.1 D20.2(Anode) D21.2(Anode) D22.2(Anode) IC10.3(GND2) IC11.3(GND2) IC15.3(GND2) Q22.3(S) Q23.3(S) Q24.3(S) Q25.3(S) Q26.3(S) Q27.3(S) Q28.3(S) Q29.3(S) Q30.3(S) ; port V0_AL, port V0_BL, port V0_CL, port V-
VA_CSensor: IC14.OUT ; port IA_CSensor
VB_CSensor: IC12.OUT ; port IB_CSensor
VC_CSensor: IC13.OUT ; port IC_CSensor
VN_AH: C63.1 C73.2 C74.2 C81.2 C82.2 IC7.1(VEE2) IC7.8(VEE2) Q4.3(C) ; port VN_AH
VN_AL: C96.1 C106.2 C107.2 C114.2 C115.2 IC10.1(VEE2) IC10.8(VEE2) Q10.3(C) ; port VN_AL
VN_BH: C64.1 C77.2 C78.2 C83.2 C84.2 IC8.1(VEE2) IC8.8(VEE2) Q5.3(C) ; port VN_BH
VN_BL: C97.1 C110.2 C111.2 C116.2 C117.2 IC11.1(VEE2) IC11.8(VEE2) Q11.3(C) ; port VN_BL
VN_CH: C65.1 C79.2 C80.2 C85.2 C86.2 IC6.1(VEE2) IC6.8(VEE2) Q6.3(C) ; port VN_CH
VN_CL: C98.1 C112.2 C113.2 C118.2 C119.2 IC15.1(VEE2) IC15.8(VEE2) Q12.3(C) ; port VN_CL
VP_AH: C57.1 C58.1 C63.2 C66.1 C67.1 D11.1(Cathode) IC7.5(VCC2) Q1.3(C) ; port VP_AH
VP_AL: C90.1 C91.1 C96.2 C99.1 C100.1 D23.1(Cathode) IC10.5(VCC2) Q7.3(C) ; port VP_AL
VP_BH: C59.1 C60.1 C64.2 C68.1 C69.1 D12.1(Cathode) IC8.5(VCC2) Q2.3(C) ; port VP_BH
VP_BL: C92.1 C93.1 C97.2 C101.1 C102.1 D24.1(Cathode) IC11.5(VCC2) Q8.3(C) ; port VP_BL
VP_CH: C61.1 C62.1 C65.2 C70.1 C71.1 D13.1(Cathode) IC6.5(VCC2) Q3.3(C) ; port VP_CH
VP_CL: C94.1 C95.1 C98.2 C103.1 C104.1 D25.1(Cathode) IC15.5(VCC2) Q9.3(C) ; port VP_CL
NetC54_1: C54.1 D8.1(Cathode) IC7.2(DESAT) R54.1
NetC55_1: C55.1 D9.1(Cathode) IC8.2(DESAT) R55.1
NetC56_1: C56.1 D10.1(Cathode) IC6.2(DESAT) R56.1
NetC87_1: C87.1 D20.1(Cathode) IC10.2(DESAT) R69.1
NetC88_1: C88.1 D21.1(Cathode) IC11.2(DESAT) R70.1
NetC89_1: C89.1 D22.1(Cathode) IC15.2(DESAT) R71.1
NetD2_1: D2.1(Cathode) R54.2
NetD2_2: D2.2(Anode) D3.2(Anode)
NetD4_1: D4.1(Cathode) R55.2
NetD4_2: D4.2(Anode) D5.2(Anode)
NetD6_1: D6.1(Cathode) R56.2
NetD6_2: D6.2(Anode) D7.2(Anode)
NetD11_2: D11.2(Anode) R57.2 R66.2 R93.1 R94.1 R95.1 ; port GATE_AH
NetD12_2: D12.2(Anode) R58.2 R67.2 R86.1 R87.1 R88.1 ; port GATE_BH
NetD13_2: D13.2(Anode) R59.2 R68.2 R90.1 R91.1 R92.1 ; port GATE_CH
NetD14_1: D14.1(Cathode) R69.2
NetD14_2: D14.2(Anode) D15.2(Anode)
NetD16_1: D16.1(Cathode) R70.2
NetD16_2: D16.2(Anode) D17.2(Anode)
NetD18_1: D18.1(Cathode) R71.2
NetD18_2: D18.2(Anode) D19.2(Anode)
NetD23_2: D23.2(Anode) R72.2 R81.2 R102.1 R103.1 R104.1 ; port GATE_AL
NetD24_2: D24.2(Anode) R73.2 R82.2 R96.1 R97.1 R98.1 ; port GATE_BL
NetD25_2: D25.2(Anode) R74.2 R83.2 R99.1 R100.1 R101.1 ; port GATE_CL
NetIC6_6: IC6.6(OUT) R64.1
NetIC6_14: IC6.14(/RST) IC15.14(/RST) ; port GD_RESET_FILT-C
NetIC7_6: IC7.6(OUT) R60.1
NetIC7_14: IC7.14(/RST) IC10.14(/RST) ; port GD_RESET_FILT-A
NetIC8_6: IC8.6(OUT) R62.1
NetIC8_14: IC8.14(/RST) IC11.14(/RST) ; port GD_RESET_FILT-B
NetIC10_6: IC10.6(OUT) R75.1
NetIC11_6: IC11.6(OUT) R77.1
NetIC15_6: IC15.6(OUT) R79.1
NetQ1_1: Q1.1(B) Q4.1(B) R60.2 R61.1
NetQ1_2: Q1.2(E) Q4.2(E) R57.1 R61.2 R66.1
NetQ2_1: Q2.1(B) Q5.1(B) R62.2 R63.1
NetQ2_2: Q2.2(E) Q5.2(E) R58.1 R63.2 R67.1
NetQ3_1: Q3.1(B) Q6.1(B) R64.2 R65.1
NetQ3_2: Q3.2(E) Q6.2(E) R59.1 R65.2 R68.1
NetQ7_1: Q7.1(B) Q10.1(B) R75.2 R76.1
NetQ7_2: Q7.2(E) Q10.2(E) R72.1 R76.2 R81.1
NetQ8_1: Q8.1(B) Q11.1(B) R77.2 R78.1
NetQ8_2: Q8.2(E) Q11.2(E) R73.1 R78.2 R82.1
NetQ9_1: Q9.1(B) Q12.1(B) R79.2 R80.1
NetQ9_2: Q9.2(E) Q12.2(E) R74.1 R80.2 R83.1
NetQ13_1: Q13.1(G) R86.2
NetQ14_1: Q14.1(G) R87.2
NetQ15_1: Q15.1(G) R88.2
NetQ16_1: Q16.1(G) R90.2
NetQ17_1: Q17.1(G) R91.2
NetQ18_1: Q18.1(G) R92.2
NetQ19_1: Q19.1(G) R93.2
NetQ20_1: Q20.1(G) R94.2
NetQ21_1: Q21.1(G) R95.2
NetQ22_1: Q22.1(G) R96.2
NetQ23_1: Q23.1(G) R97.2
NetQ24_1: Q24.1(G) R98.2
NetQ25_1: Q25.1(G) R99.2
NetQ26_1: Q26.1(G) R100.2
NetQ27_1: Q27.1(G) R101.2
NetQ28_1: Q28.1(G) R102.2
NetQ29_1: Q29.1(G) R103.2
NetQ30_1: Q30.1(G) R104.2

Not connected (* = marked no-connect by the designer): IC6 4(NC) 7(CLAMP); IC7 4(NC) 7(CLAMP); IC8 4(NC) 7(CLAMP); IC10 4(NC) 7(CLAMP); IC11 4(NC) 7(CLAMP); IC15 4(NC) 7(CLAMP)

### Notes on the sheet
- Gate Drive Current = 2A
  DESAT: Desaturation protection
  CLAMP: Miller clamping
  RDY: Ready output
  -Open-drain output to report the correct operation of the device (RDY = high if both chips are above the UVLO level and the internal chip transmission is faultless).
  /FLT: Fault Output, low active
  -It is low in a fault case
  /RST: Reset input, low active
- VP_XL: 15V
  VN_XL: -3V

### Library data of the parts
C54-C122 = CAP0805
D11-D13 D23-D25 = B5819W: DIODE SCHOTTKY 1A 40V SOD123
Q1-Q3 Q7-Q9 = ZXTN25020CFHTA: NPN 4.5A SOT23
Q4-Q6 Q10-Q12 = ZXTP25020CFHTA: PNP 4A SOT23
R54-R83 = RES0805
R86-R88 R90-R104 = 249k 1206: 1206 RES

## Sheet DCDC CONV.SchDoc
size B portrait
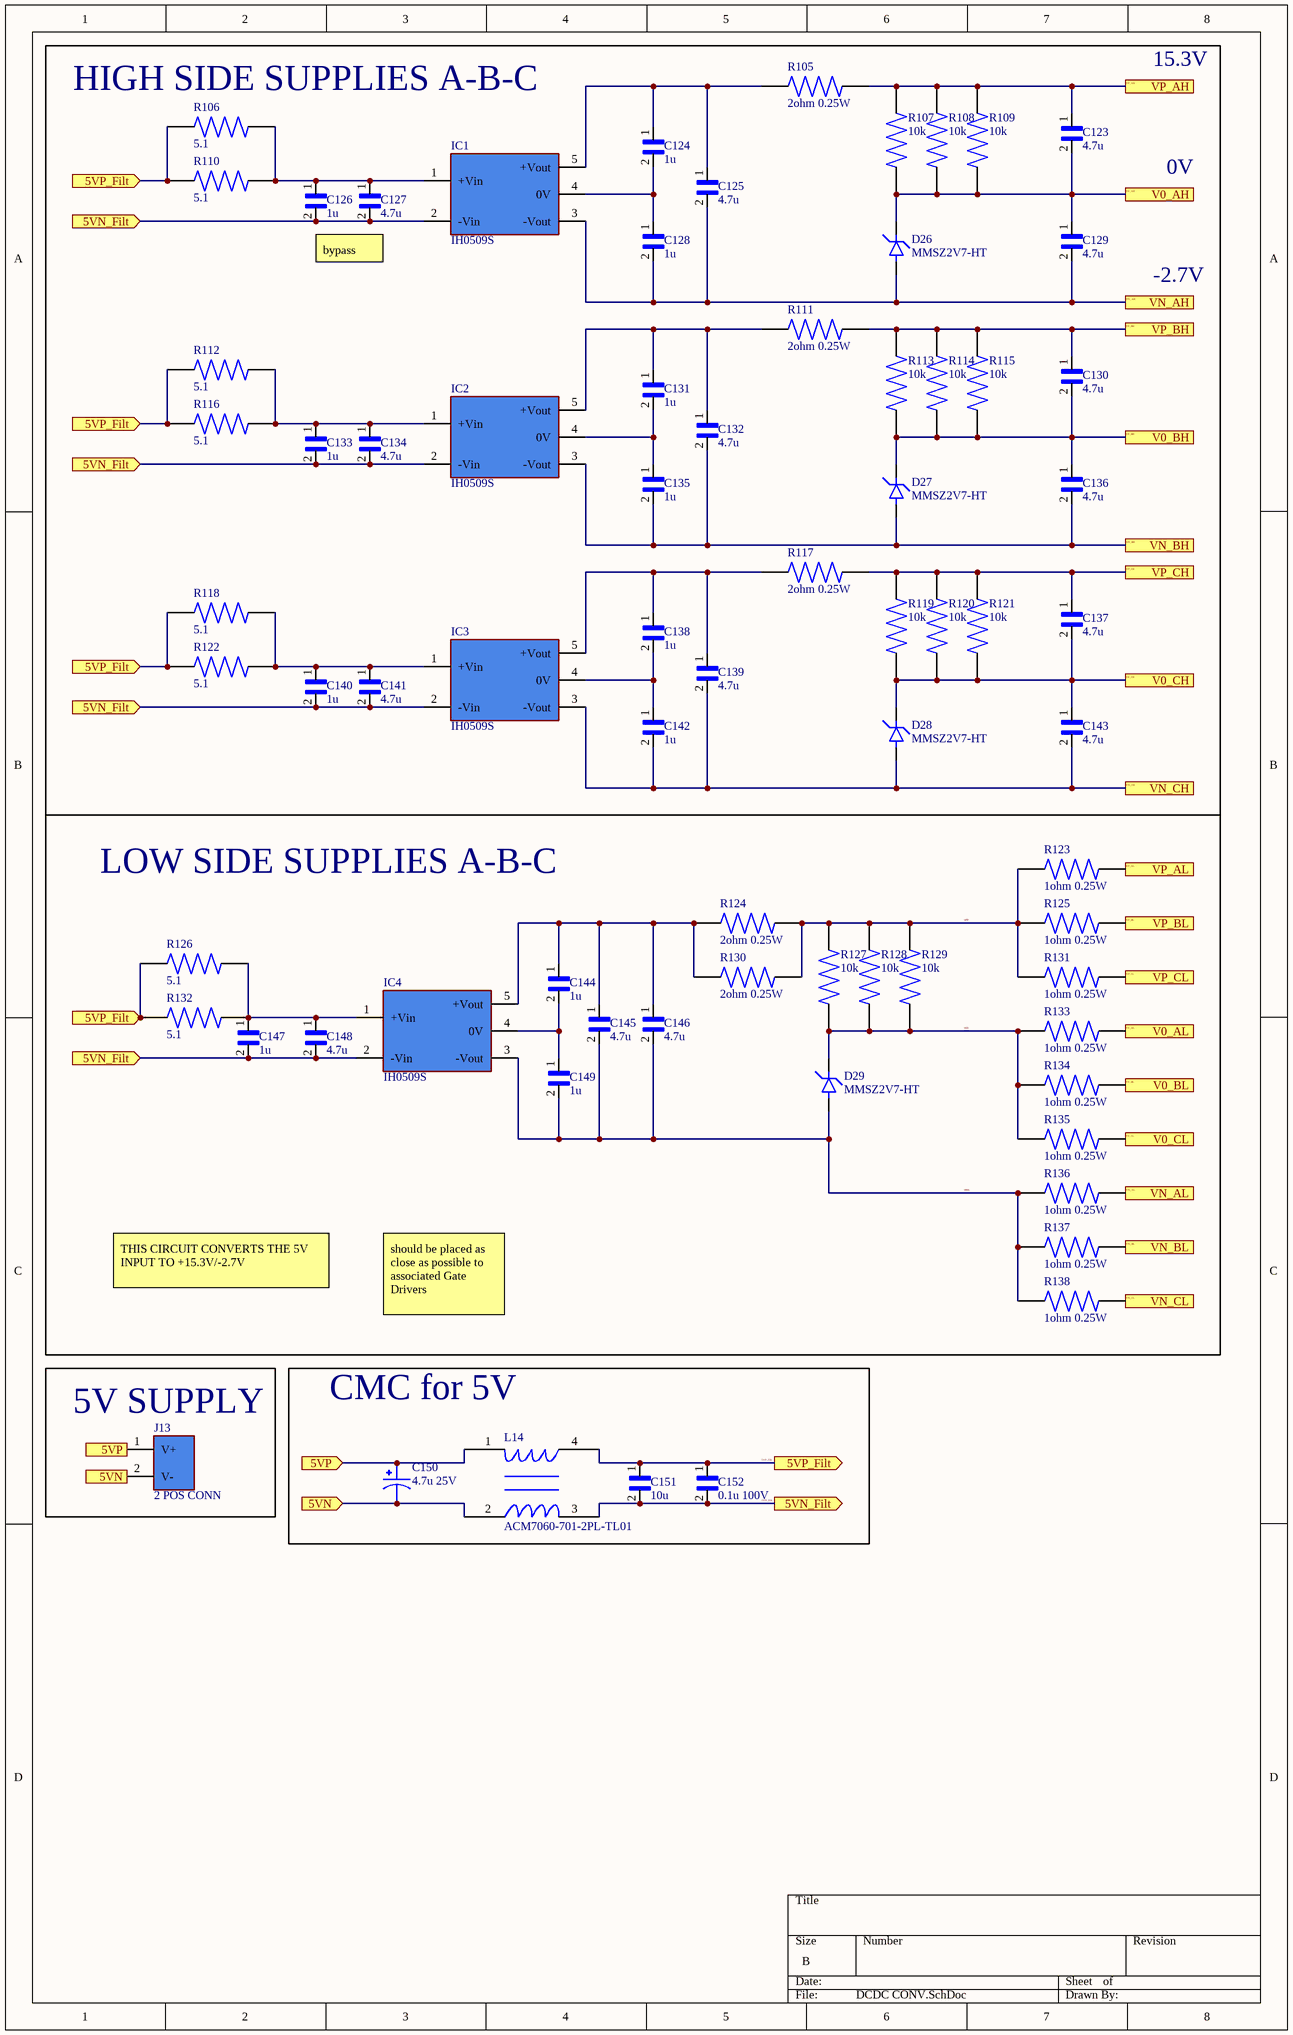
[diagram p10: DCDC CONV.SchDoc]

### Parts
C123  4.7u  [CAP 0805]
C124  1u  [CAP 0805]
C125  4.7u  [CAP 0805]
C126  1u  [CAP 0805]
C127  4.7u  [CAP 0805]
C128  1u  [CAP 0805]
C129  4.7u  [CAP 0805]
C130  4.7u  [CAP 0805]
C131  1u  [CAP 0805]
C132  4.7u  [CAP 0805]
C133  1u  [CAP 0805]
C134  4.7u  [CAP 0805]
C135  1u  [CAP 0805]
C136  4.7u  [CAP 0805]
C137  4.7u  [CAP 0805]
C138  1u  [CAP 0805]
C139  4.7u  [CAP 0805]
C140  1u  [CAP 0805]
C141  4.7u  [CAP 0805]
C142  1u  [CAP 0805]
C143  4.7u  [CAP 0805]
C144  1u  [CAP 0805]
C145  4.7u  [CAP 0805]
C146  4.7u  [CAP 0805]
C147  1u  [CAP 0805]
C148  4.7u  [CAP 0805]
C149  1u  [CAP 0805]
C150  4.7u 25V  [EEE-HC1E470XP]
C151  10u  [CAP 0805]
C152  0.1u 100V  [CAP 0805]
D26  MMSZ2V7-HT  [SOD123]
D27  MMSZ2V7-HT  [SOD123]
D28  MMSZ2V7-HT  [SOD123]
D29  MMSZ2V7-HT  [SOD123]
IC1  IH0509S  [IH0509S]
IC2  IH0509S  [IH0509S]
IC3  IH0509S  [IH0509S]
IC4  IH0509S  [IH0509S]
J13  2 POS CONN  [2POS CONN]
L14  ACM7060-701-2PL-TL01  [ACM7060-701-2PL-TL01]
R105  2ohm 0.25W  [RES 0805 (2012 metric)]
R106  5.1  [RES 0805 (2012 metric)]
R107  10k  [RES 0805 (2012 metric)]
R108  10k  [RES 0805 (2012 metric)]
R109  10k  [RES 0805 (2012 metric)]
R110  5.1  [RES 0805 (2012 metric)]
R111  2ohm 0.25W  [RES 0805 (2012 metric)]
R112  5.1  [RES 0805 (2012 metric)]
R113  10k  [RES 0805 (2012 metric)]
R114  10k  [RES 0805 (2012 metric)]
R115  10k  [RES 0805 (2012 metric)]
R116  5.1  [RES 0805 (2012 metric)]
R117  2ohm 0.25W  [RES 0805 (2012 metric)]
R118  5.1  [RES 0805 (2012 metric)]
R119  10k  [RES 0805 (2012 metric)]
R120  10k  [RES 0805 (2012 metric)]
R121  10k  [RES 0805 (2012 metric)]
R122  5.1  [RES 0805 (2012 metric)]
R123  1ohm 0.25W  [RES 0805 (2012 metric)]
R124  2ohm 0.25W  [RES 0805 (2012 metric)]
R125  1ohm 0.25W  [RES 0805 (2012 metric)]
R126  5.1  [RES 0805 (2012 metric)]
R127  10k  [RES 0805 (2012 metric)]
R128  10k  [RES 0805 (2012 metric)]
R129  10k  [RES 0805 (2012 metric)]
R130  2ohm 0.25W  [RES 0805 (2012 metric)]
R131  1ohm 0.25W  [RES 0805 (2012 metric)]
R132  5.1  [RES 0805 (2012 metric)]
R133  1ohm 0.25W  [RES 0805 (2012 metric)]
R134  1ohm 0.25W  [RES 0805 (2012 metric)]
R135  1ohm 0.25W  [RES 0805 (2012 metric)]
R136  1ohm 0.25W  [RES 0805 (2012 metric)]
R137  1ohm 0.25W  [RES 0805 (2012 metric)]
R138  1ohm 0.25W  [RES 0805 (2012 metric)]

### Blocks framed on the sheet
5V SUPPLY: J13
CMC for 5V: C150-C152 L14

### Ports
5VN (in), 5VN_Filt (in), 5VN_Filt (out), 5VP (in), 5VP_Filt (in), 5VP_Filt (out), V0_AH, V0_AL, V0_BH, V0_BL, V0_CH, V0_CL, VN_AH, VN_AL, VN_BH, VN_BL, VN_CH, VN_CL, VP_AH, VP_AL, VP_BH, VP_BL, VP_CH, VP_CL

### Nets
5VN_FIlt: C126.2 C127.2 C133.2 C134.2 C140.2 C141.2 C147.2 C148.2 C151.2 C152.2 IC1.2(-Vin) IC2.2(-Vin) IC3.2(-Vin) IC4.2(-Vin) L14.3 ; port 5VN_Filt
5VP_FIlt: C151.1 C152.1 L14.4 R106.1 R110.1 R112.1 R116.1 R118.1 R122.1 R126.1 R132.1 ; port 5VP_Filt
V00: D29.1(Cathode) R127.1 R128.1 R129.1 R133.2 R134.2 R135.2
V0_AH: C123.2 C129.1 D26.1(Cathode) R107.1 R108.1 R109.1 ; port V0_AH
V0_AL: R133.1 R134.1 R135.1 ; port V0_CL, port V0_BL, port V0_AL  [also labelled V0_BL, V0_CL]  [project net V-]
V0_BH: C130.2 C136.1 D27.1(Cathode) R113.1 R114.1 R115.1 ; port V0_BH
V0_CH: C137.2 C143.1 D28.1(Cathode) R119.1 R120.1 R121.1 ; port V0_CH
VN_AH: C125.2 C128.2 C129.2 D26.2(Anode) IC1.3(-Vout) ; port VN_AH
VN_AL: R136.1 ; port VN_AL
VN_BH: C132.2 C135.2 C136.2 D27.2(Anode) IC2.3(-Vout) ; port VN_BH
VN_BL: R137.1 ; port VN_BL
VN_CH: C139.2 C142.2 C143.2 D28.2(Anode) IC3.3(-Vout) ; port VN_CH
VN_CL: R138.1 ; port VN_CL
VNN: C145.2 C146.2 C149.2 D29.2(Anode) IC4.3(-Vout) R136.2 R137.2 R138.2
VP_AH: C123.1 R105.2 R107.2 R108.2 R109.2 ; port VP_AH
VP_AL: R123.1 ; port VP_AL
VP_BH: C130.1 R111.2 R113.2 R114.2 R115.2 ; port VP_BH
VP_BL: R125.1 ; port VP_BL
VP_CH: C137.1 R117.2 R119.2 R120.2 R121.2 ; port VP_CH
VP_CL: R131.1 ; port VP_CL
VPP: R123.2 R124.2 R125.2 R127.2 R128.2 R129.2 R130.2 R131.2
NetC124_1: C124.1 C125.1 IC1.5(+Vout) R105.1
NetC124_2: C124.2 C128.1 IC1.4(0V)
NetC126_1: C126.1 C127.1 IC1.1(+Vin) R106.2 R110.2
NetC131_1: C131.1 C132.1 IC2.5(+Vout) R111.1
NetC131_2: C131.2 C135.1 IC2.4(0V)
NetC133_1: C133.1 C134.1 IC2.1(+Vin) R112.2 R116.2
NetC138_1: C138.1 C139.1 IC3.5(+Vout) R117.1
NetC138_2: C138.2 C142.1 IC3.4(0V)
NetC140_1: C140.1 C141.1 IC3.1(+Vin) R118.2 R122.2
NetC144_1: C144.1 C145.1 C146.1 IC4.5(+Vout) R124.1 R130.1
NetC144_2: C144.2 C149.1 IC4.4(0V)
NetC147_1: C147.1 C148.1 IC4.1(+Vin) R126.2 R132.2
NetC150_1: C150.1 J13.1(V+) L14.1 ; port 5VP
NetC150_2: C150.2 J13.2(V-) L14.2 ; port 5VN

### Notes on the sheet
- (near R106) HIGH SIDE SUPPLIES A-B-C
- 15.3V
- 0V
- bypass
- -2.7V
- LOW SIDE SUPPLIES A-B-C
- THIS CIRCUIT CONVERTS THE 5V INPUT TO +15.3V/-2.7V
- should be placed as close as possible to associated Gate Drivers

### Library data of the parts
C123 C125 C127 C129 C130 C132 C134 C136 C137 C139 C141 C143 C145 C146 C148 = 56pF 0805: 4.7u 0805
C124 C126 C128 C131 C133 C135 C138 C140 C142 C144 C147 C149 = 56pF 0805: 1u0805
C150 = EEE-HC1E4
C151 = 0.1uF 0805: 10uF
C152 = 0.1uF 0805
D26-D29 = MMSZ2V7-HT: MMSZ2V7-HT / 2.7V ZENER
R105-R138 = 120ohm 0805

## Nets that join several sheets
5VN_FIlt: Circuit (7 pins), DCDC CONV (15 pins)
+5_Cntrl: Circuit (14 pins), Gate Drives (12 pins)
+5_CURRENTSENS: Circuit (J5.2), Gate Drives (6 pins)
GND_Cntrl: Circuit (59 pins), Gate Drives (24 pins)
GND_CURRENTSENS: Circuit (5 pins), Gate Drives (6 pins)
5VP_FIlt: Circuit (C153.1 PS1.3 R23.2), DCDC CONV (11 pins)
A-FAULT-HS: Circuit (R6.1), Gate Drives (IC7.13)
A-FAULT-LS: Circuit (R1.1), Gate Drives (IC10.13)
A-RDY-HS: Circuit (R5.1), Gate Drives (IC7.12)
A-RDY-LS: Circuit (R2.1), Gate Drives (IC10.12)
AHS_PWM_IN: Circuit (U5.2), Gate Drives (IC7.10)
ALS_PWM_IN: Circuit (U8.2), Gate Drives (IC10.10)
B-FAULT-HS: Circuit (R4.2), Gate Drives (IC8.13)
B-FAULT-LS: Circuit (R8.2), Gate Drives (IC11.13)
B-RDY-HS: Circuit (R3.2), Gate Drives (IC8.12)
B-RDY-LS: Circuit (R7.2), Gate Drives (IC11.12)
BHS_PWM_IN: Circuit (U3.2), Gate Drives (IC8.10)
BLS_PWM_IN: Circuit (U7.2), Gate Drives (IC11.10)
C-FAULT-HS: Circuit (R17.1), Gate Drives (IC6.13)
C-FAULT-LS: Circuit (R19.1), Gate Drives (IC15.13)
C-RDY-HS: Circuit (R18.1), Gate Drives (IC6.12)
C-RDY-LS: Circuit (R20.1), Gate Drives (IC15.12)
CHS_PWM_IN: Circuit (U6.2), Gate Drives (IC6.10)
CLS_PWM_IN: Circuit (U9.2), Gate Drives (IC15.10)
NetIC6_14: Circuit (J3.8), Gate Drives (IC6.14 IC15.14)
NetIC7_14: Circuit (J1.8), Gate Drives (IC7.14 IC10.14)
NetIC8_14: Circuit (J2.8), Gate Drives (IC8.14 IC11.14)
V0_AH: Gate Drives (21 pins), DCDC CONV (6 pins)
V0_BH: Gate Drives (21 pins), DCDC CONV (6 pins)
V0_CH: Gate Drives (21 pins), DCDC CONV (6 pins)
V+: Circuit (18 pins), Gate Drives (12 pins)
V-: Circuit (18 pins), Gate Drives (42 pins), DCDC CONV (R133.1 R134.1 R135.1)
VA_CSensor: Circuit (J5.1), Gate Drives (IC14.OUT)
VB_CSensor: Circuit (J5.5), Gate Drives (IC12.OUT)
VC_CSensor: Circuit (J5.9), Gate Drives (IC13.OUT)
VN_AH: Gate Drives (8 pins), DCDC CONV (5 pins)
VN_AL: Gate Drives (8 pins), DCDC CONV (R136.1)
VN_BH: Gate Drives (8 pins), DCDC CONV (5 pins)
VN_BL: Gate Drives (8 pins), DCDC CONV (R137.1)
VN_CH: Gate Drives (8 pins), DCDC CONV (5 pins)
VN_CL: Gate Drives (8 pins), DCDC CONV (R138.1)
VP_AH: Gate Drives (8 pins), DCDC CONV (5 pins)
VP_AL: Gate Drives (8 pins), DCDC CONV (R123.1)
VP_BH: Gate Drives (8 pins), DCDC CONV (5 pins)
VP_BL: Gate Drives (8 pins), DCDC CONV (R125.1)
VP_CH: Gate Drives (8 pins), DCDC CONV (5 pins)
VP_CL: Gate Drives (8 pins), DCDC CONV (R131.1)